# EAGLE design SSRPGenericTelemetryModule (EAGLE 6.3)
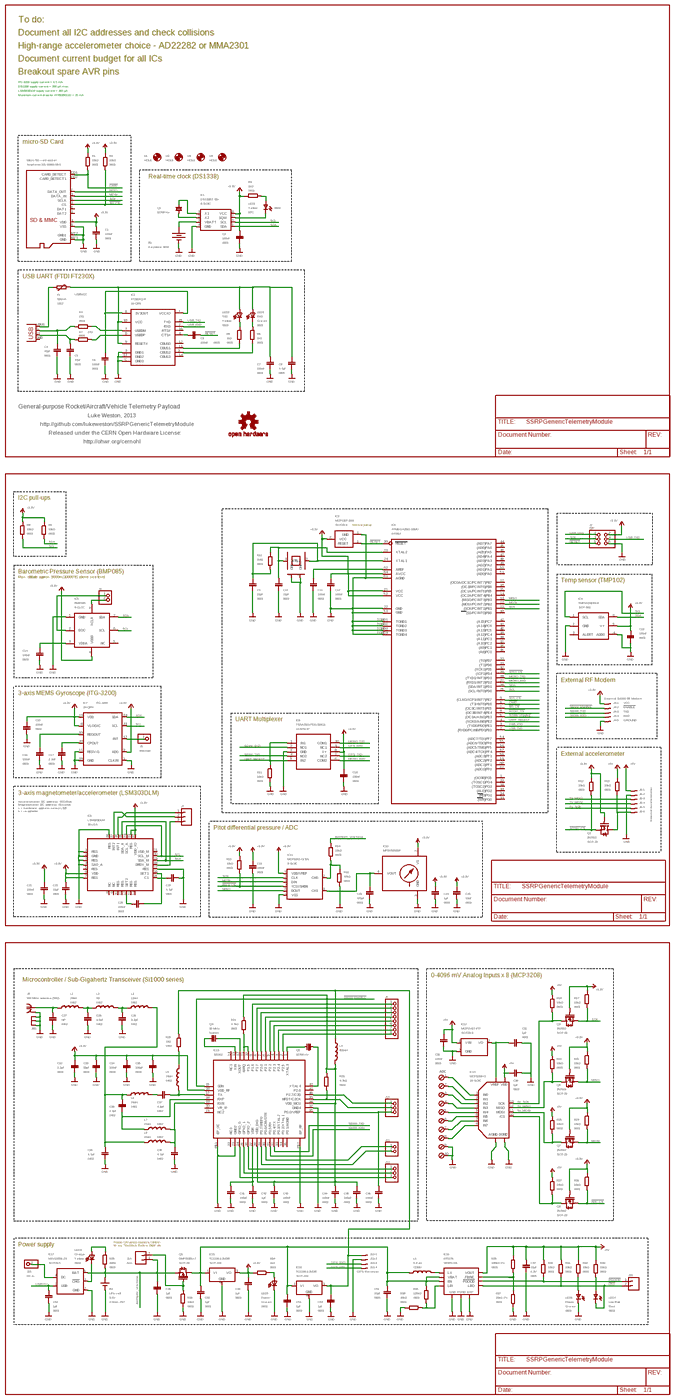
[diagram p0: schematic, sheet 1, overview]
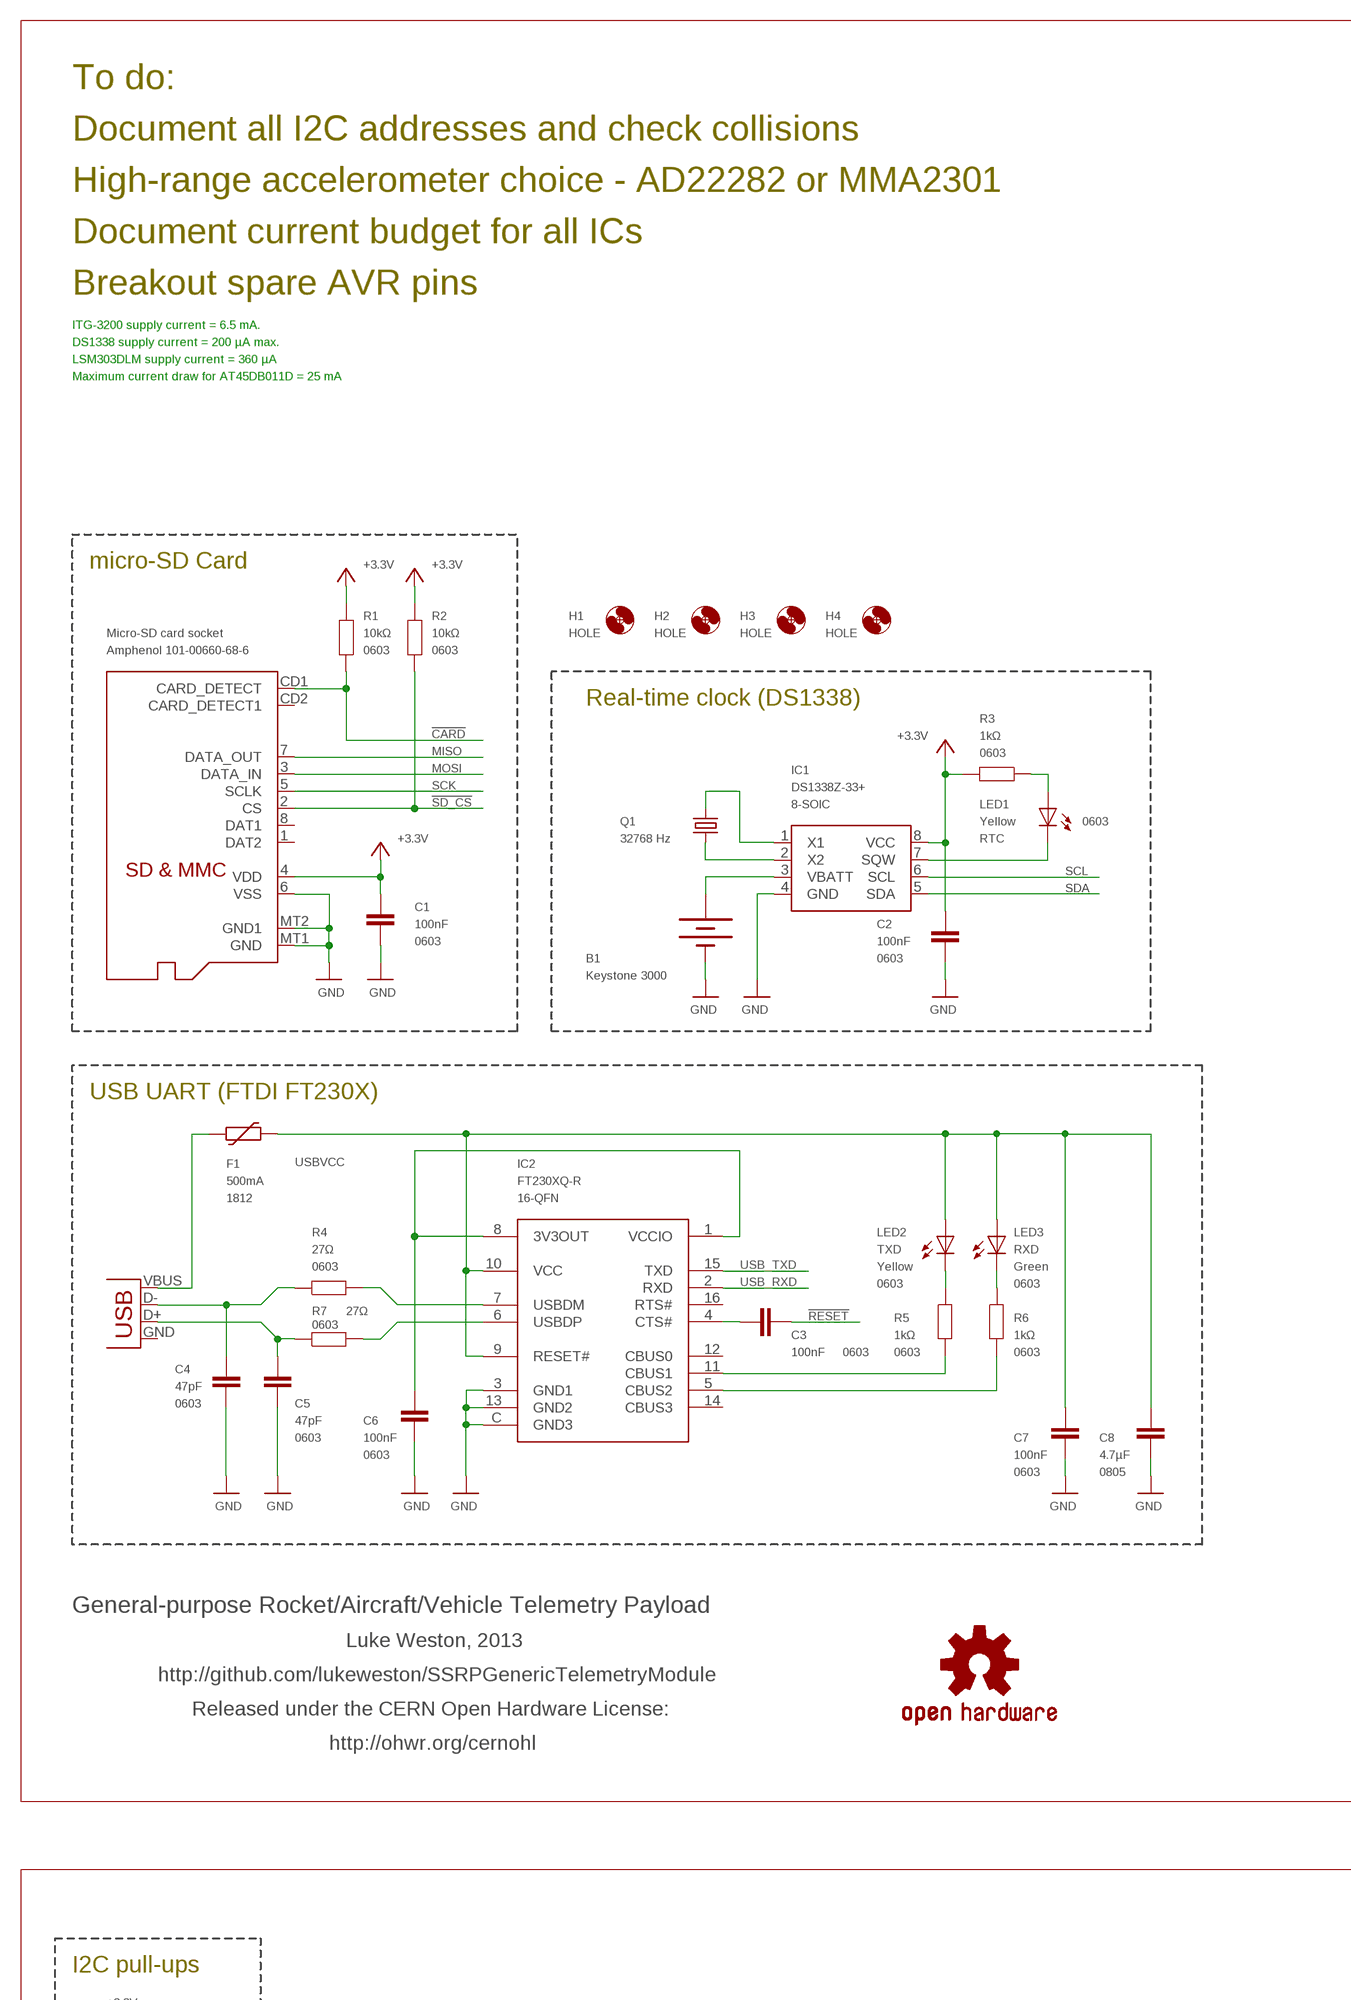
[diagram p1: schematic, sheet 1, part 1 of 6]
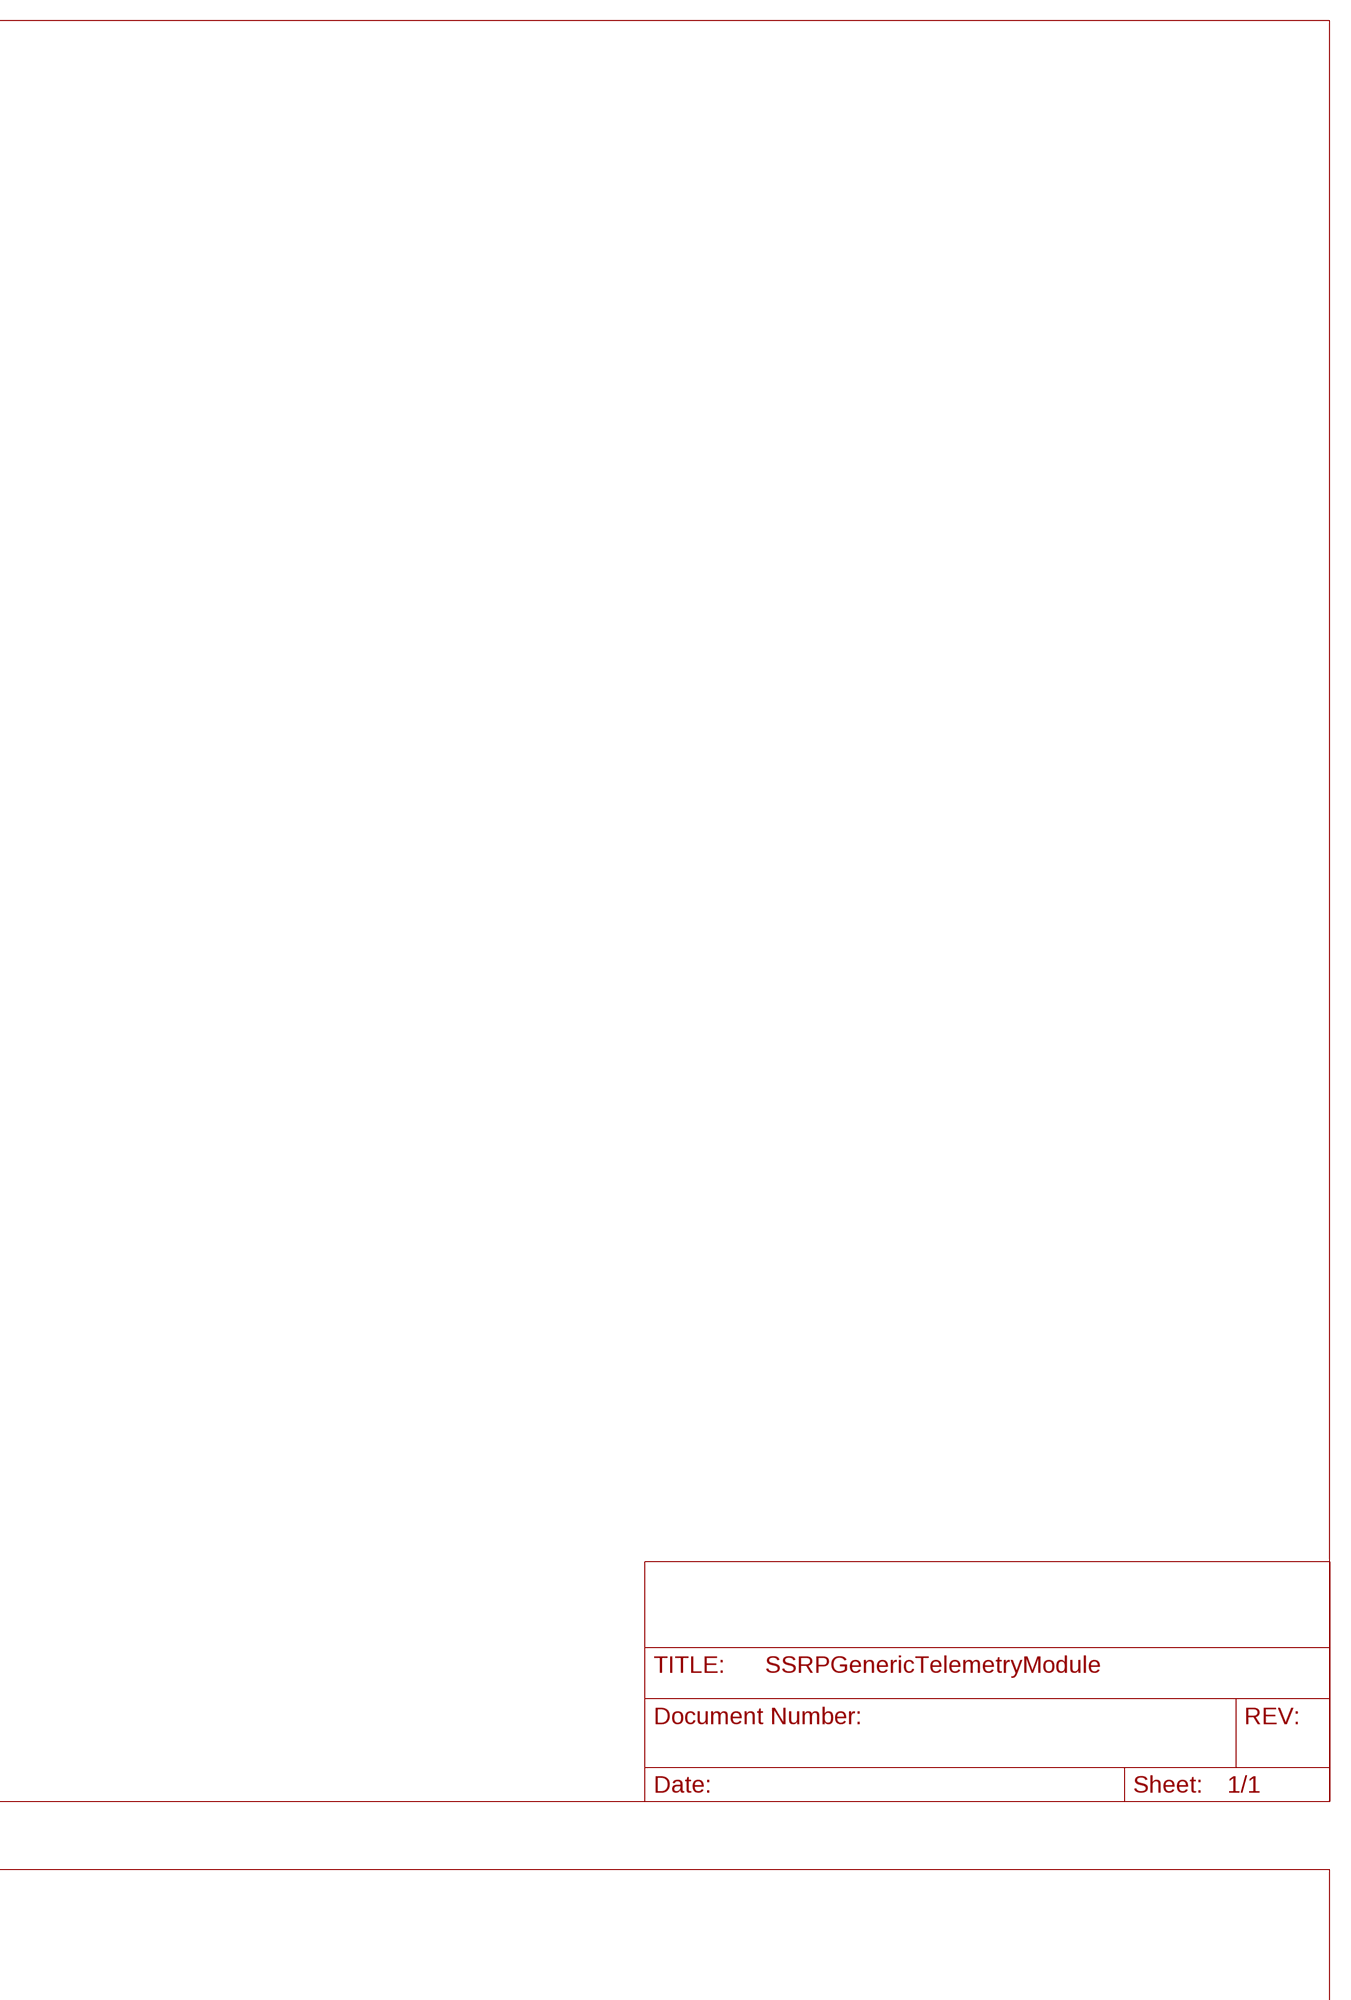
[diagram p2: schematic, sheet 1, part 2 of 6]
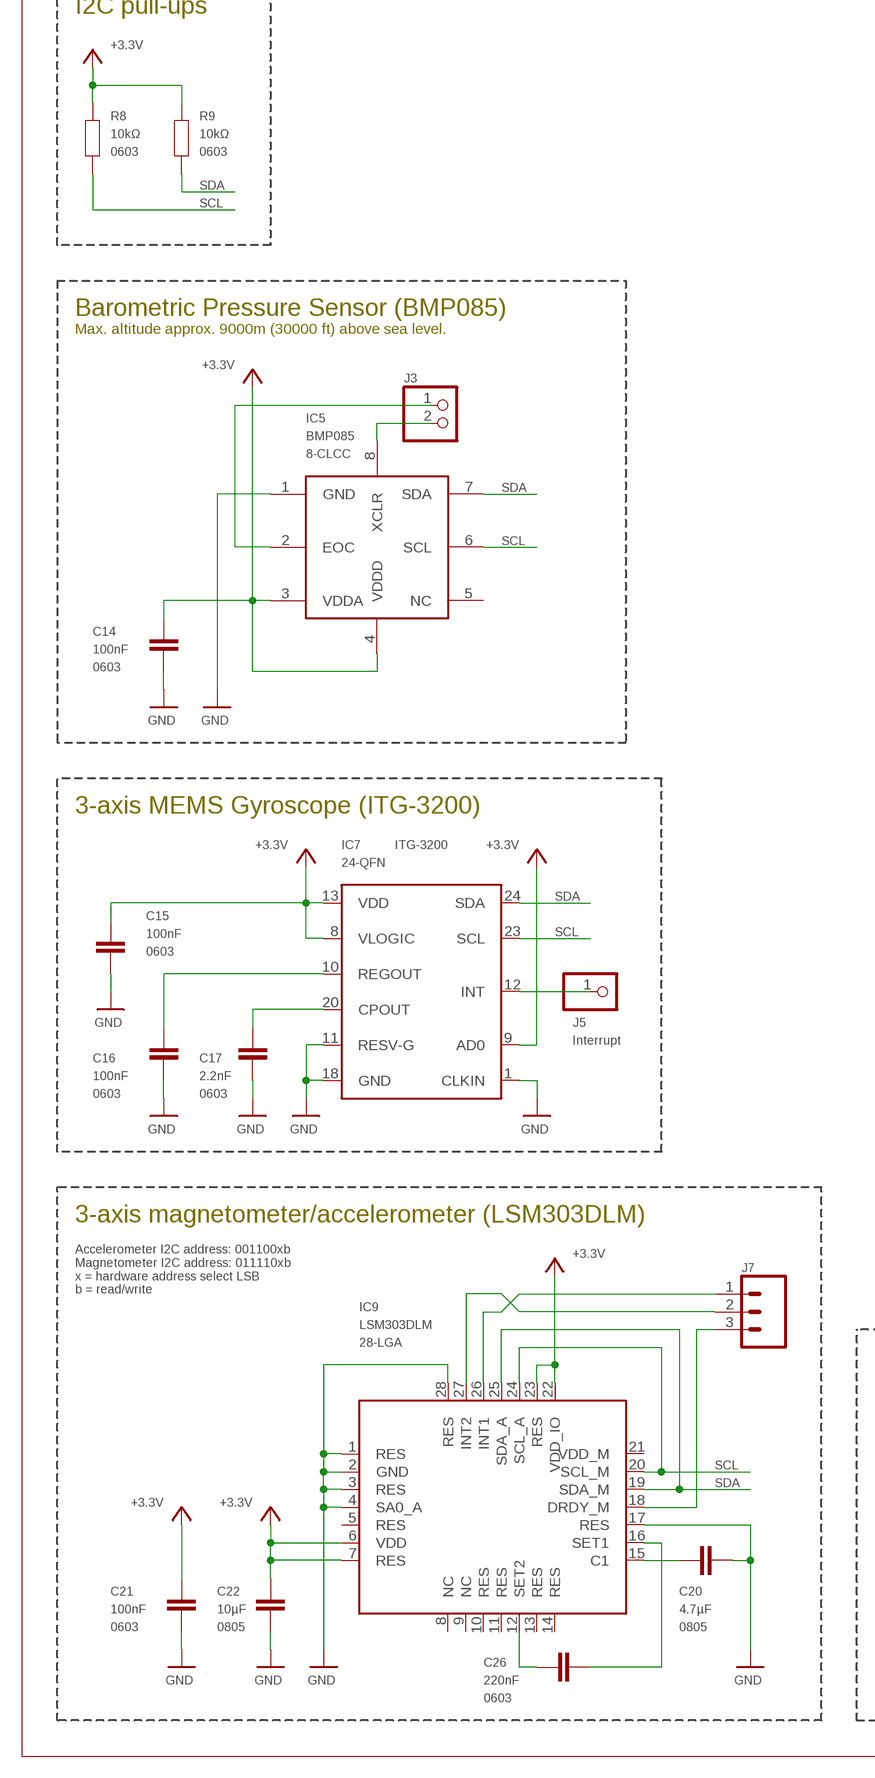
[diagram p3: schematic, sheet 1, part 3 of 6]
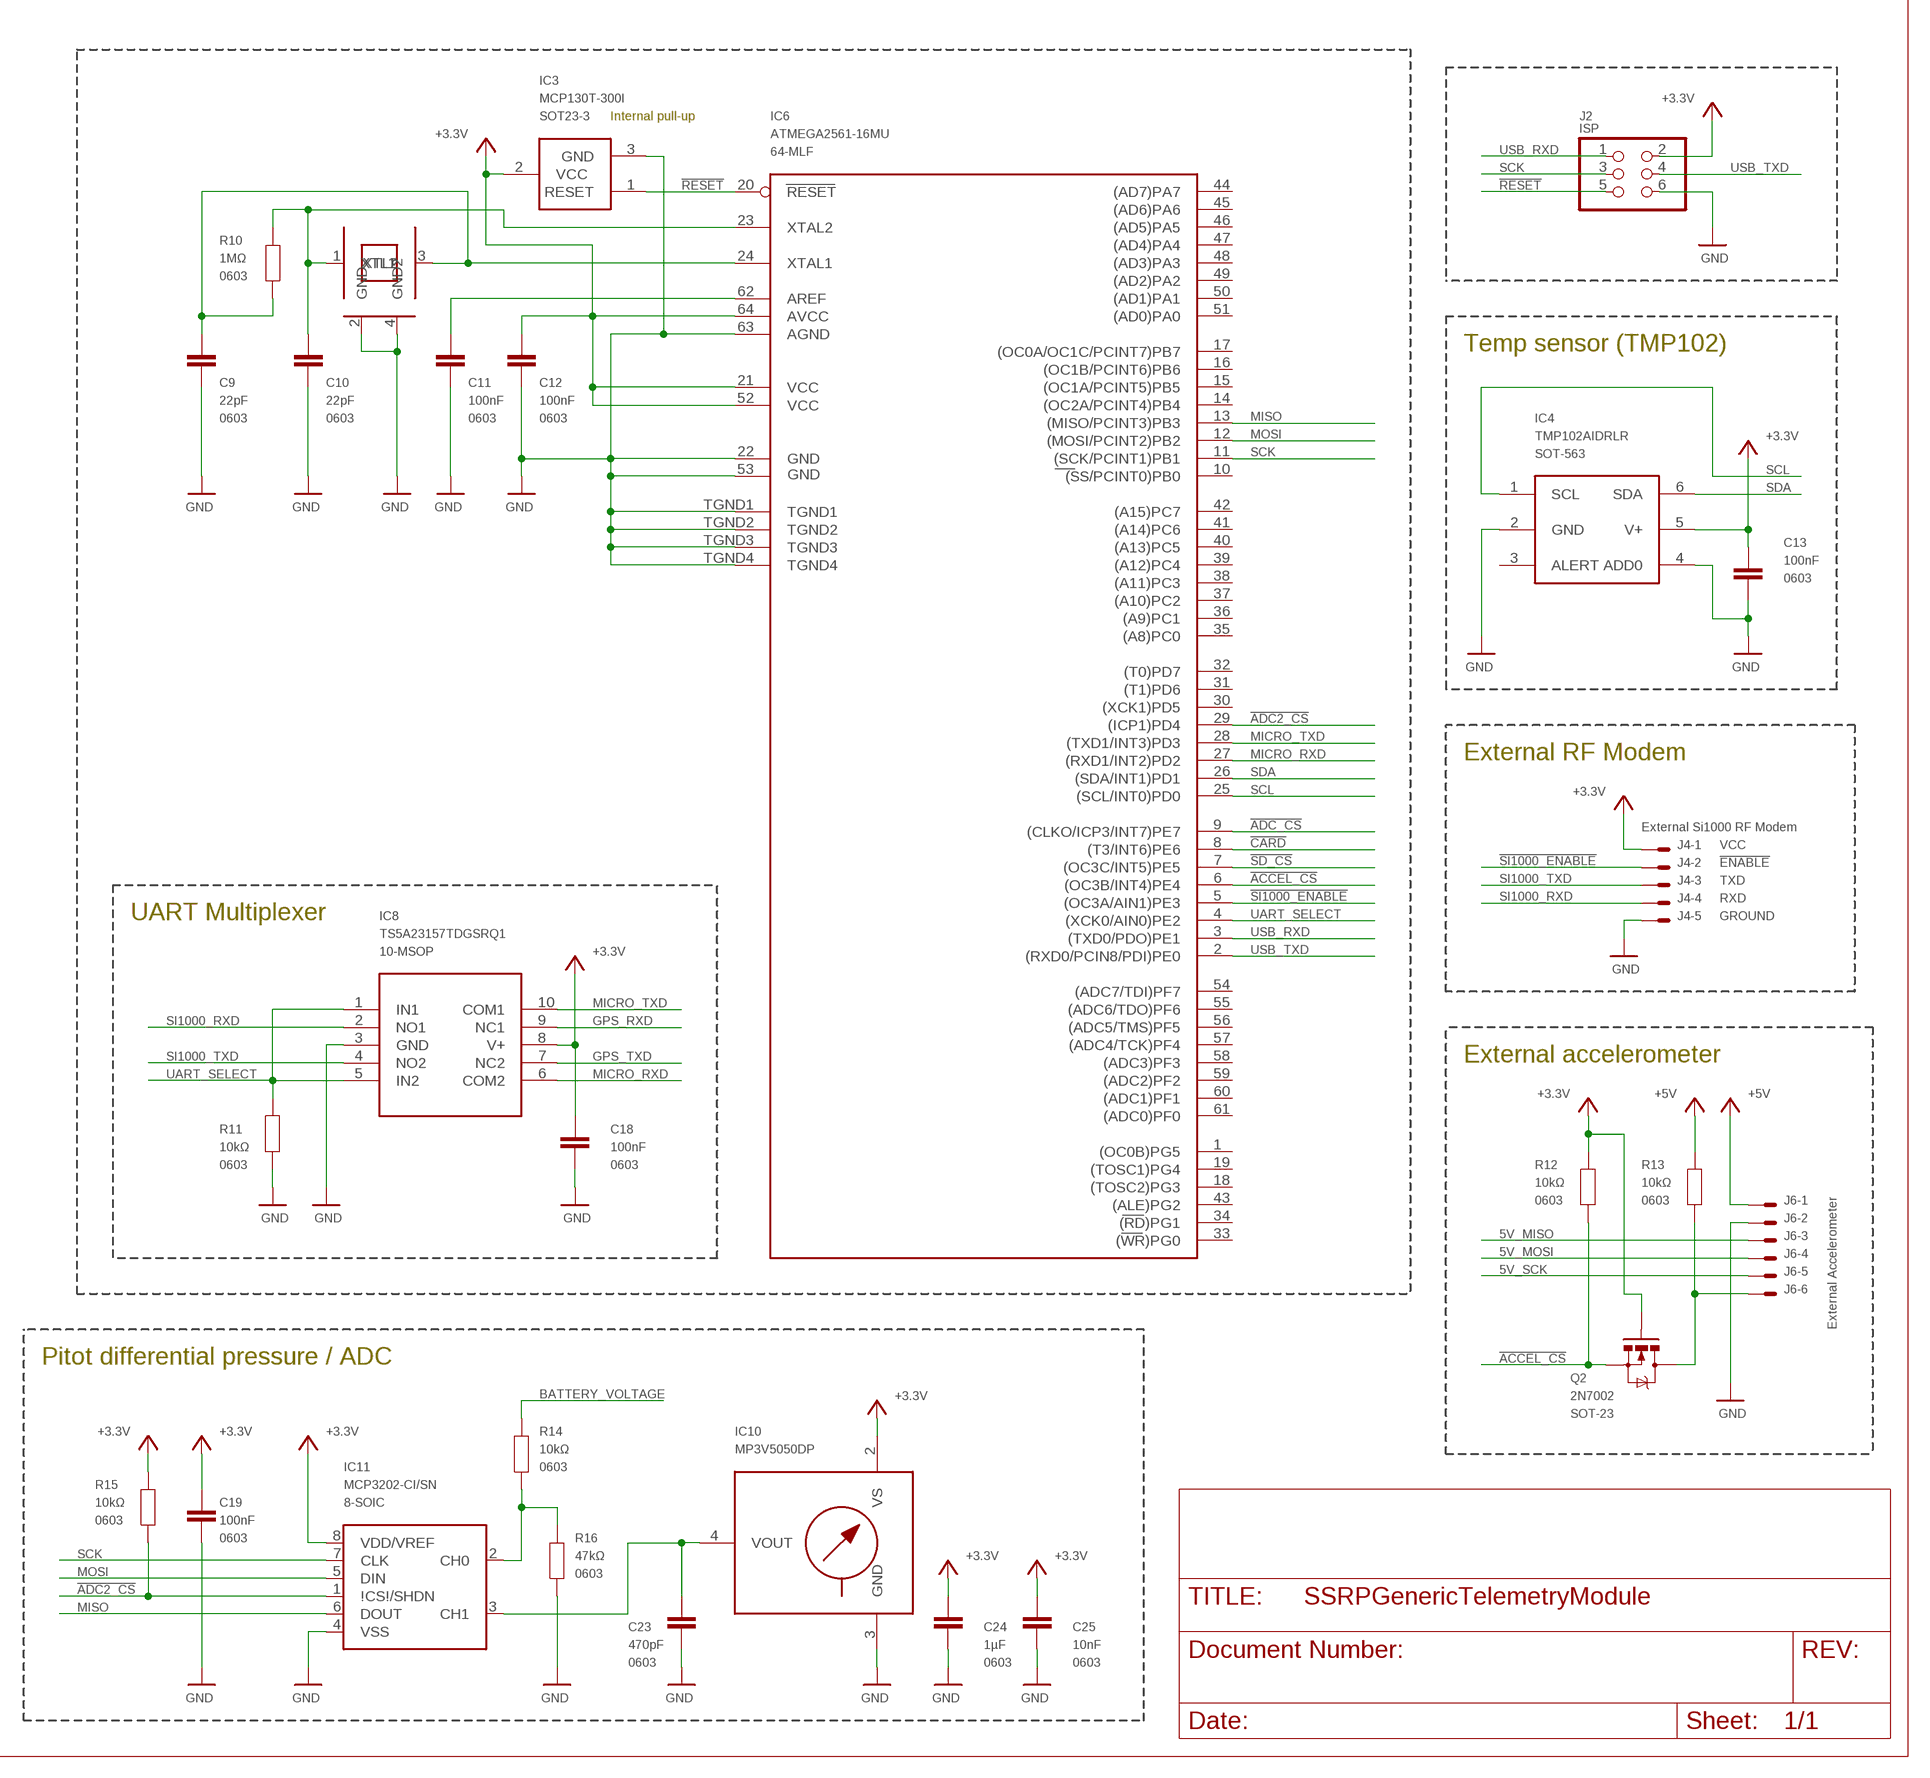
[diagram p4: schematic, sheet 1, part 4 of 6]
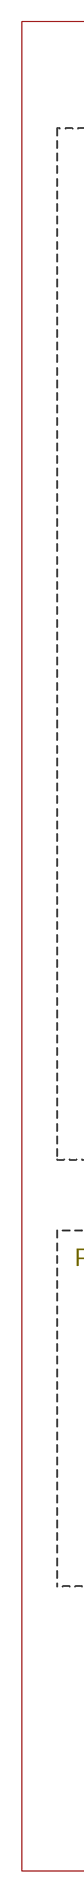
[diagram p5: schematic, sheet 1, part 5 of 6]
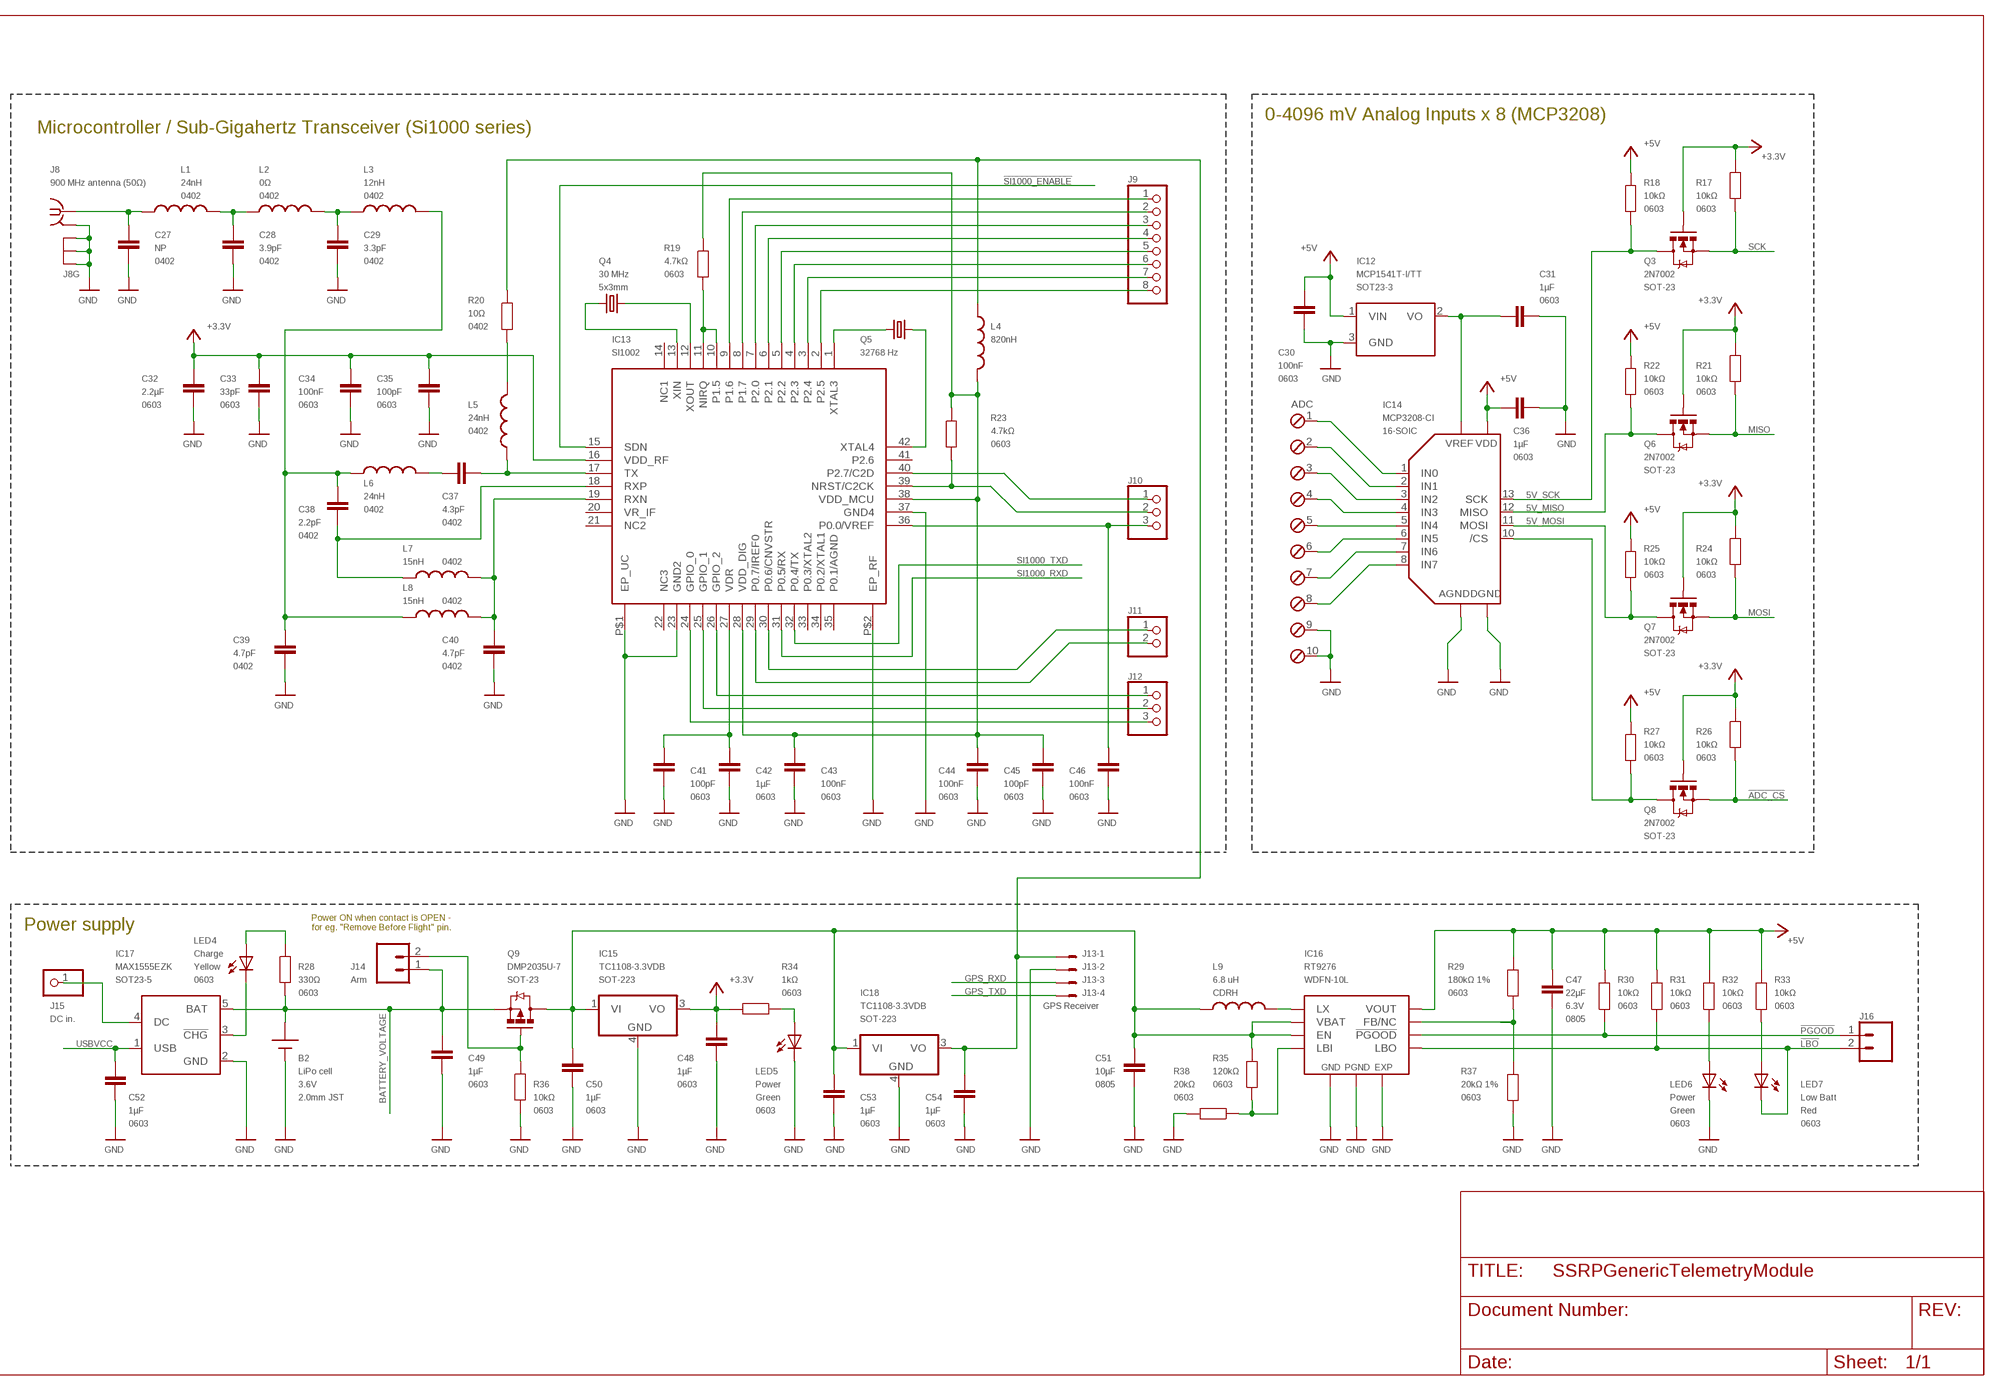
[diagram p6: schematic, sheet 1, part 6 of 6]

## Parts
B1  Keystone 3000  BATTERY12MM  [BATTCON_12MM]
B2  LiPo cell  2P-JST-TH-RA  [JST-2MM-TH-RA]
C1  100nF  CAP0603  [0603]
C2  100nF  CAP0603  [0603]
C3  100nF  CAP0603  [0603]
C4  47pF  CAP0603  [0603]
C5  47pF  CAP0603  [0603]
C6  100nF  CAP0603  [0603]
C7  100nF  CAP0603  [0603]
C8  4.7µF  CAP0805  [0805]
C9  22pF  CAP0603  [0603]
C10  22pF  CAP0603  [0603]
C11  100nF  CAP0603  [0603]
C12  100nF  CAP0603  [0603]
C13  100nF  CAP0603  [0603]
C14  100nF  CAP0603  [0603]
C15  100nF  CAP0603  [0603]
C16  100nF  CAP0603  [0603]
C17  2.2nF  CAP0603  [0603]
C18  100nF  CAP0603  [0603]
C19  100nF  CAP0603  [0603]
C20  4.7µF  CAP0805  [0805]
C21  100nF  CAP0603  [0603]
C22  10µF  CAP0805  [0805]
C23  470pF  CAP0603  [0603]
C24  1µF  CAP0603  [0603]
C25  10nF  CAP0603  [0603]
C26  220nF  CAP0603  [0603]
C27  NP  CAP0402  [C0402]
C28  3.9pF  CAP0402  [C0402]
C29  3.3pF  CAP0402  [C0402]
C30  100nF  CAP0603  [0603]
C31  1µF  CAP0603  [0603]
C32  2.2µF  CAP0603  [0603]
C33  33pF  CAP0603  [0603]
C34  100nF  CAP0603  [0603]
C35  100pF  CAP0603  [0603]
C36  1µF  CAP0603  [0603]
C37  4.3pF  CAP0402  [C0402]
C38  2.2pF  CAP0402  [C0402]
C39  4.7pF  CAP0402  [C0402]
C40  4.7pF  CAP0402  [C0402]
C41  100pF  CAP0603  [0603]
C42  1µF  CAP0603  [0603]
C43  100nF  CAP0603  [0603]
C44  100nF  CAP0603  [0603]
C45  100pF  CAP0603  [0603]
C46  100nF  CAP0603  [0603]
C47  22µF  CAP0805  [0805]
C48  1µF  CAP0603  [0603]
C49  1µF  CAP0603  [0603]
C50  1µF  CAP0603  [0603]
C51  10µF  CAP0805  [0805]
C52  1µF  CAP0603  [0603]
C53  1µF  CAP0603  [0603]
C54  1µF  CAP0603  [0603]
F1  500mA  PTC  [1812]
H1  HOLE  MOUNT-HOLE3.2  [3,2]
H2  HOLE  MOUNT-HOLE3.2  [3,2]
H3  HOLE  MOUNT-HOLE3.2  [3,2]
H4  HOLE  MOUNT-HOLE3.2  [3,2]
IC1  DS1338Z-33+  DS1307SO8  [SO08@1]
IC2  FT230XQ-R  FT230XQ  [QFN4X4-16]
IC3  MCP130T-300I  MCP130SOT  [SOT23-3]
IC4  TMP102AIDRLR  TMP102  [SOT563]
IC5  BMP085  [BMP085]
IC6  ATMEGA2561-16MU  [MLF64]
IC7  ITG-3200  [QFN-24]
IC8  TS5A23157TDGSRQ1  TS5A23157  [MSOP10]
IC9  LSM303DLM  LSM303DLHSMD  [LGA28-5X5]
IC10  MP3V5050DP  MPXV5004GDP  [1351]
IC11  MCP3202-CI/SN  MCP3202SN  [SO-08]
IC12  MCP1541T-I/TT  MC1541TT  [SOT23]
IC13  SI1002  SI1001NORMAL  [QFN42_MCM]
IC14  MCP3208-CI  MCP3208MCP3208-SOIC  [SOIC16]
IC15  TC1108-3.3VDB  LM340MP-05  [SOT223]
IC16  RT9276  [WDFN-10L-3X3]
IC17  MAX1555EZK  MAX1555  [SOT23-5L]
IC18  TC1108-3.3VDB  LM340MP-05  [SOT223]
J1  MicroSD Card  ADAFRUIT_MICROSD  [ADAFRUIT_MICROSD]
J2  ISP  ICSPPTH  [2X03PTH]
J3  PINHD-1X2  [1X02]
J4  External Si1000 RF Modem  22-23-2051  [22-23-2051]
J5  Interrupt  PINHD-1X1  [1X01]
J6  External Accelerometer  22-05-7068-06  [7395-06]
J7  M03PTH  [1X03]
J8  900 MHz antenna (50Ω)  SMA-142-0701-801/806  [J502-ND-142-0701-801/806]
J9  PINHD-1X8  [1X08]
J10  PINHD-1X3  [1X03]
J11  PINHD-1X2  [1X02]
J12  PINHD-1X3  [1X03]
J13  GPS Receiver  22-05-7048-04  [7395-04]
J14  Arm  M02PTH  [1X02]
J15  DC in.  PINHD-1X1  [1X01]
J16  Status  M02PTH  [1X02]
L1  24nH  INDUCTOR0402  [C0402]
L2  0Ω  INDUCTOR0402  [C0402]
L3  12nH  INDUCTOR0402  [C0402]
L4  820nH  INDUCTOR0402  [C0402]
L5  24nH  INDUCTOR0402  [C0402]
L6  24nH  INDUCTOR0402  [C0402]
L7  15nH  INDUCTOR0402  [C0402]
L8  15nH  INDUCTOR0402  [C0402]
L9  6.8 uH  INDUCTOR  [CDRH]
LED1  RTC  LED0603  [LED-0603]
LED2  TXD  LED0603  [LED-0603]
LED3  RXD  LED0603  [LED-0603]
LED4  Charge  LED0603  [LED-0603]
LED5  Power  LED0603  [LED-0603]
LED6  Power  LED0603  [LED-0603]
LED7  Low Batt  LED0603  [LED-0603]
Q1  32768 Hz  CRYSTAL-SMD3215_TST  [SMD3215_XTAL]
Q2  2N7002  MOSFET-NCHANNELSMD  [SOT23-3]
Q3  2N7002  MOSFET-NCHANNELSMD  [SOT23-3]
Q4  30 MHz  CRYSTAL5X3  [CRYSTAL-SMD-5X3]
Q5  32768 Hz  CRYSTAL-SMD3215_TST  [SMD3215_XTAL]
Q6  2N7002  MOSFET-NCHANNELSMD  [SOT23-3]
Q7  2N7002  MOSFET-NCHANNELSMD  [SOT23-3]
Q8  2N7002  MOSFET-NCHANNELSMD  [SOT23-3]
Q9  DMP2035U-7  [SOT23-3]
R1  10kΩ  RESISTOR0603  [0603]
R2  10kΩ  RESISTOR0603  [0603]
R3  1kΩ  RESISTOR0603  [0603]
R4  27Ω  RESISTOR0603  [0603]
R5  1kΩ  RESISTOR0603  [0603]
R6  1kΩ  RESISTOR0603  [0603]
R7  27Ω  RESISTOR0603  [0603]
R8  10kΩ  RESISTOR0603  [0603]
R9  10kΩ  RESISTOR0603  [0603]
R10  1MΩ  RESISTOR0603  [0603]
R11  10kΩ  RESISTOR0603  [0603]
R12  10kΩ  RESISTOR0603  [0603]
R13  10kΩ  RESISTOR0603  [0603]
R14  10kΩ  RESISTOR0603  [0603]
R15  10kΩ  RESISTOR0603  [0603]
R16  47kΩ  RESISTOR0603  [0603]
R17  10kΩ  RESISTOR0603  [0603]
R18  10kΩ  RESISTOR0603  [0603]
R19  4.7kΩ  RESISTOR0603  [0603]
R20  10Ω  RESISTOR0402  [C0402]
R21  10kΩ  RESISTOR0603  [0603]
R22  10kΩ  RESISTOR0603  [0603]
R23  4.7kΩ  RESISTOR0603  [0603]
R24  10kΩ  RESISTOR0603  [0603]
R25  10kΩ  RESISTOR0603  [0603]
R26  10kΩ  RESISTOR0603  [0603]
R27  10kΩ  RESISTOR0603  [0603]
R28  330Ω  RESISTOR0603  [0603]
R29  180kΩ 1%  RESISTOR0603  [0603]
R30  10kΩ  RESISTOR0603  [0603]
R31  10kΩ  RESISTOR0603  [0603]
R32  10kΩ  RESISTOR0603  [0603]
R33  10kΩ  RESISTOR0603  [0603]
R34  1kΩ  RESISTOR0603  [0603]
R35  120kΩ  RESISTOR0603  [0603]
R36  10kΩ  RESISTOR0603  [0603]
R37  20kΩ 1%  RESISTOR0603  [0603]
R38  20kΩ  RESISTOR0603  [0603]
SY  OSHW-LOGOS  [OSHW-LOGO-S]
X1  USB-MICROB  [USB-MICROB]
X2  ADC  MPT10  [10POL254]
XTL1  SMD3225-16MHZ 3.2 x 2.5mm crystal  CRYSTAL-GND3X2  [CRYSTAL-SMD-3X2]

## Nets
5V_MISO: IC14.12(MISO) J6.3 Q6.3(D) R22.1
5V_MOSI: IC14.11(MOSI) J6.4 Q7.3(D) R25.1
5V_SCK: IC14.13(SCK) J6.5 Q3.3(D) R18.1
!ACCEL_CS: IC6.6((OC3B/INT4)PE4) Q2.2(S) R12.1
!ADC2_CS: IC6.29((ICP1)PD4) IC11.1(\!CS\!/SHDN) R15.1
!ADC_CS: IC6.9((CLKO/ICP3/INT7)PE7) Q8.2(S) R26.1
!ADC_CS_5V: IC14.10(/CS) Q8.3(D) R27.1
!CARD: IC6.8((T3/INT6)PE6) J1.CD1(CARD_DETECT) R1.2
!LBO: IC16.4(LBO) J16.2 LED7.C R31.1
!PGOOD: IC16.8(!PGOOD) J16.1 R30.1
!RESET: C3.2 IC3.1(RESET) IC6.20(RESET) J2.5
!SD_CS: IC6.7((OC3C/INT5)PE5) J1.2(CS) R2.2
!SI1000_ENABLE: IC6.5((OC3A/AIN1)PE3) IC13.15(SDN) J4.2
+3V3: C1.1 C2.1 C12.1 C13.1 C14.1 C15.1 C18.2 C19.1 C21.2 C22.2 C24.1 C25.1 C32.2 C33.2 C34.2 C35.2 C48.1 IC1.8(VCC) IC3.2(VCC) IC4.5(V+) IC5.3(VDDA) IC5.4(VDDD) IC6.21(VCC) IC6.52(VCC1) IC6.64(AVCC) IC7.8(VLOGIC) IC7.9(AD0) IC7.13(VDD) IC8.8(V+) IC9.6(VDD) IC9.7(RES) IC9.22(VDD_IO) IC9.23(RES) IC10.2(VS) IC11.8(VDD/VREF) IC13.16(VDD_RF) IC15.3(VO) J1.4(VDD) J2.2 J4.1 Q2.1(G) Q3.1(G) Q6.1(G) Q7.1(G) Q8.1(G) R1.1 R2.1 R3.2 R8.2 R9.2 R12.2 R15.2 R17.2 R21.2 R24.2 R26.2 R34.2 ; supply symbol labelled +3.3V
+5V: C30.2 C36.1 C47.1 IC12.1(VIN) IC14.16(VDD) IC16.2(VOUT) J6.1 R13.2 R18.2 R22.2 R25.2 R27.2 R29.2 R30.2 R31.2 R32.2 R33.2
ANALOG_BAROMETER: C23.1 IC10.4(VOUT) IC11.3(CH1)
BATTERY_VOLTAGE: B2.+ C49.1 IC17.5(BAT) J14.1 Q9.2(S) R14.2 R28.1
FB1: IC16.3(FB/NC) R29.1 R37.2
GND: B1.GND(-) B2.- C1.2 C2.2 C4.2 C5.2 C6.2 C7.2 C8.2 C9.2 C10.2 C11.2 C12.2 C13.2 C14.2 C15.2 C16.2 C17.2 C18.1 C19.2 C20.2 C21.1 C22.1 C23.2 C24.2 C25.2 C27.2 C28.2 C29.2 C30.1 C31.2 C32.1 C33.1 C34.1 C35.1 C36.2 C39.2 C40.2 C41.1 C42.1 C43.1 C44.1 C45.1 C46.1 C47.2 C48.2 C49.2 C50.2 C51.2 C52.2 C53.2 C54.2 IC1.4(GND) IC2.3(GND1) IC2.13(GND2) IC2.C(GND3) IC3.3(GND) IC4.2(GND) IC4.4(ADD0) IC5.1(GND) IC6.22(GND) IC6.53(GND1) IC6.63(AGND) IC6.TGND1 IC6.TGND2 IC6.TGND3 IC6.TGND4 IC7.1(CLKIN) IC7.11(RESV-G) IC7.18(GND) IC8.3(GND) IC9.1(RES) IC9.2(GND) IC9.3(RES) IC9.4(SA0_A) IC9.17(RES) IC9.28(RES) IC10.3(GND) IC11.4(VSS) IC12.3(GND) IC13.23(GND2) IC13.37(GND4) IC13.EP1(GND5) IC13.EP2(GND6) IC13.EP3(GND7) IC13.EP4(GND8) IC13.EP5(GND9) IC13.EP6(GND10) IC13.EP7(GND11) IC13.EP8(GND12) IC13.P$1(EP_UC) IC13.P$2(EP_RF) IC14.9(DGND) IC14.14(AGND) IC15.4(GND) IC16.5(GND) IC16.10(PGND) IC16.EXP IC17.2(GND) IC18.4(GND) J1.6(VSS) J1.MT1(GND) J1.MT2(GND1) J2.6 J4.5 J6.2 J8.G@1(GND) J8.G@2(GND) J8.G@3(GND) J8.G@4(GND) J13.2 LED5.C LED6.C R11.1 R16.1 R36.1 R37.1 R38.1 X2.9 X2.10 XTL1.2(GND) XTL1.4(GND2)
GPS_RXD: IC8.9(NC1) J13.3
GPS_TXD: IC8.7(NC2) J13.4
LBI1: IC16.7(LBI) R35.1 R38.2
LX1: IC16.9(LX) L9.2
MICRO_RXD: IC6.27((RXD1/INT2)PD2) IC8.6(COM2)
MICRO_TXD: IC6.28((TXD1/INT3)PD3) IC8.10(COM1)
MISO: IC6.13((MISO/PCINT3)PB3) IC11.6(DOUT) J1.7(DATA_OUT) Q6.2(S) R21.1
MOSI: IC6.12((MOSI/PCINT2)PB2) IC11.5(DIN) J1.3(DATA_IN) Q7.2(S) R24.1
N$1: J6.6 Q2.3(D) R13.1
N$2: C43.2 C44.2 C45.2 IC13.28(VDD_DIG) IC13.38(VDD_MCU) L4.1 R19.2 R23.2
N$3: C38.2 IC13.18(RXP) L7.2
N$4: IC13.40(P2.7/C2D) J10.1
N$5: IC9.18(DRDY_M) J7.3
N$6: C27.1 J8.1 L1.1
N$7: IC13.1(XTAL3) Q5.X2
N$8: IC13.42(XTAL4) Q5.X1
N$9: IC13.30(P0.6/CNVSTR) J11.1
N$10: IC9.27(INT2) J7.2
N$11: C11.1 IC6.62(AREF)
N$12: IC1.2(X2) Q1.X2
N$13: B1.PWR@1(+) IC1.3(VBATT)
N$14: IC1.1(X1) Q1.X1
N$15: IC1.7(SQW) LED1.C
N$16: IC9.26(INT1) J7.1
N$17: C26.1 IC9.12(SET2)
N$18: C26.2 IC9.16(SET1)
N$19: C10.1 IC6.23(XTAL2) R10.1 XTL1.1(XTL1)
N$20: C20.1 IC9.15(C1)
N$21: IC13.29(P0.7/IREF0) J11.2
N$22: IC7.12(INT) J5.1
N$23: C9.1 IC6.24(XTAL1) R10.2 XTL1.3(XTL2)
N$24: LED1.A R3.1
N$25: C16.1 IC7.10(REGOUT)
N$26: LED2.C R5.2
N$27: C17.1 IC7.20(CPOUT)
N$28: C54.1 IC18.3(VO) J13.1 L4.2 R20.2
N$29: IC14.8(IN7) X2.8
N$30: IC14.7(IN6) X2.7
N$31: LED3.C R6.2
N$32: C6.1 IC2.1(VCCIO) IC2.8(3V3OUT)
N$33: IC5.8(XCLR) J3.2
N$34: IC5.2(EOC) J3.1
N$35: IC11.2(CH0) R14.1 R16.2
N$36: IC14.6(IN5) X2.6
N$37: IC14.5(IN4) X2.5
N$38: IC14.4(IN3) X2.4
N$39: IC14.3(IN2) X2.3
N$40: IC14.2(IN1) X2.2
N$41: IC14.1(IN0) X2.1
N$42: IC2.7(USBDM) R4.2
N$43: C31.1 IC12.2(VO) IC14.15(VREF)
N$44: LED6.A R32.1
N$45: IC2.6(USBDP) R7.2
N$46: C5.1 R7.1 X1.D+
N$47: C4.1 R4.1 X1.D-
N$48: F1.1 X1.VBUS
N$49: IC2.11(CBUS1) R5.1
N$50: IC2.5(CBUS2) R6.1
N$51: C3.1 IC2.4(CTS#)
N$52: LED7.A R33.1
N$54: IC13.24(GPIO_0) J12.3
N$55: IC13.25(GPIO_1) J12.2
N$56: IC13.26(GPIO_2) J12.1
N$58: C41.2 C42.2 IC13.27(VDR)
N$59: C46.2 IC13.36(P0.0/VREF) J10.3
N$60: J14.2 Q9.1(G) R36.2
N$61: IC17.3(!CHG) LED4.C
N$64: LED4.A R28.2
N$65: IC17.4(DC) J15.1
N$68: LED5.A R34.1
N$69: IC13.39(NRST/C2CK) J10.2 R23.1
N$74: IC13.2(P2.5) J9.8
N$75: IC13.3(P2.4) J9.7
N$76: IC13.4(P2.3) J9.6
N$77: IC13.5(P2.2) J9.5
N$78: IC13.6(P2.1) J9.4
N$79: IC13.7(P2.0) J9.3
N$80: IC13.8(P1.7) J9.2
N$81: IC13.9(P1.6) J9.1
N$82: IC13.10(P1.5) IC13.11(NIRQ) R19.1
N$83: IC13.12(XOUT) Q4.3
N$84: IC13.13(XIN) Q4.1
N$86: C37.1 IC13.17(TX) L5.1
N$87: C37.2 L6.2
N$89: C40.1 IC13.19(RXN) L7.1 L8.1
N$90: L5.2 R20.1
N$92: C28.1 L1.2 L2.1
N$93: C29.1 L2.2 L3.1
N$96: C38.1 C39.1 L3.2 L6.1 L8.2
SCK: IC6.11((SCK/PCINT1)PB1) IC11.7(CLK) J1.5(SCLK) J2.3 Q3.2(S) R17.1
SCL: IC1.6(SCL) IC4.1(SCL) IC5.6(SCL) IC6.25((SCL/INT0)PD0) IC7.23(SCL) IC9.20(SCL_M) IC9.24(SCL_A) R8.1
SDA: IC1.5(SDA) IC4.6(SDA) IC5.7(SDA) IC6.26((SDA/INT1)PD1) IC7.24(SDA) IC9.19(SDA_M) IC9.25(SDA_A) R9.1
SI1000_RXD: IC8.2(NO1) IC13.31(P0.5/RX) J4.4
SI1000_TXD: IC8.4(NO2) IC13.32(P0.4/TX) J4.3
UART_SELECT: IC6.4((XCK0/AIN0)PE2) IC8.1(IN1) IC8.5(IN2) R11.2
USB_RXD: IC2.2(RXD) IC6.3((TXD0/PDO)PE1) J2.1
USB_TXD: IC2.15(TXD) IC6.2((RXD0/PCIN8/PDI)PE0) J2.4
USBVCC: C7.1 C8.1 C52.1 F1.2 IC2.9(RESET#) IC2.10(VCC) IC17.1(USB) LED2.A LED3.A
V_BATT: C50.1 C51.1 C53.1 IC15.1(VI) IC16.1(EN) IC16.6(VBAT) IC18.1(VI) L9.1 Q9.3(D) R35.2
Unconnected: IC2.12(CBUS0) IC2.14(CBUS3) IC2.16(RTS#) IC4.3(ALERT) IC5.5(NC) IC6.1((OC0B)PG5) IC6.10((SS/PCINT0)PB0) IC6.14((OC2A/PCINT4)PB4) IC6.15((OC1A/PCINT5)PB5) IC6.16((OC1B/PCINT6)PB6) IC6.17((OC0A/OC1C/PCINT7)PB7) IC6.18((TOSC2)PG3) IC6.19((TOSC1)PG4) IC6.30((XCK1)PD5) IC6.31((T1)PD6) IC6.32((T0)PD7) IC6.33((WR)PG0) IC6.34((RD)PG1) IC6.35((A8)PC0) IC6.36((A9)PC1) IC6.37((A10)PC2) IC6.38((A11)PC3) IC6.39((A12)PC4) IC6.40((A13)PC5) IC6.41((A14)PC6) IC6.42((A15)PC7) IC6.43((ALE)PG2) IC6.44((AD7)PA7) IC6.45((AD6)PA6) IC6.46((AD5)PA5) IC6.47((AD4)PA4) IC6.48((AD3)PA3) IC6.49((AD2)PA2) IC6.50((AD1)PA1) IC6.51((AD0)PA0) IC6.54((ADC7/TDI)PF7) IC6.55((ADC6/TDO)PF6) IC6.56((ADC5/TMS)PF5) IC6.57((ADC4/TCK)PF4) IC6.58((ADC3)PF3) IC6.59((ADC2)PF2) IC6.60((ADC1)PF1) IC6.61((ADC0)PF0) IC9.5(RES) IC9.8(NC) IC9.9(NC) IC9.10(RES) IC9.11(RES) IC9.13(RES) IC9.14(RES) IC9.21(VDD_M) IC10.1(NC) IC10.5(NC) IC10.6(NC) IC13.14(NC1) IC13.21(NC2) IC13.22(NC3) IC13.33(P0.3/XTAL2) IC13.34(P0.2/XTAL1) IC13.35(P0.1/AGND) IC13.41(P2.6) J1.1(DAT2) J1.8(DAT1) J1.CD2(CARD_DETECT1) X1.GND

## Notes on the sheet
- To do:
- Document all I2C addresses and check collisions
- High-range accelerometer choice - AD22282 or MMA2301
- Document current budget for all ICs
- Breakout spare AVR pins
- ITG-3200 supply current = 6.5 mA.
- DS1338 supply current = 200 µA max.
- LSM303DLM supply current = 360 µA
- Maximum current draw for AT45DB011D = 25 mA
- micro-SD Card
- Micro-SD card socket
- Amphenol 101-00660-68-6
- Real-time clock (DS1338)
- USB UART (FTDI FT230X)
- FT230XQ-R
- General-purpose Rocket/Aircraft/Vehicle Telemetry Payload
- Luke Weston, 2013
- http://github.com/lukeweston/SSRPGenericTelemetryModule
- Released under the CERN Open Hardware License:
- http://ohwr.org/cernohl
- I2C pull-ups
- Internal pull-up
- Barometric Pressure Sensor (BMP085)
- Max. altitude approx. 9000m (30000 ft) above sea level.
- Temp sensor (TMP102)
- IC5
- BMP085
- 8-CLCC
- External RF Modem
- 3-axis MEMS Gyroscope (ITG-3200)
- VCC
- !ENABLE
- TXD
- RXD
- UART Multiplexer | GROUND
- External accelerometer
- 3-axis magnetometer/accelerometer (LSM303DLM)
- Accelerometer I2C address: 001100xb
  Magnetometer I2C address: 011110xb
  x = hardware address select LSB
  b = read/write
- Pitot differential pressure / ADC
- 0-4096 mV Analog Inputs x 8 (MCP3208)
- Microcontroller / Sub-Gigahertz Transceiver (Si1000 series)
- Power supply
- Power ON when contact is OPEN -
  for eg. "Remove Before Flight" pin.

## Power pins joined to a net without a drawn wire
VR_IF: IC13.20(VR_IF)

## Library data of the parts
B1 = SparkFun:BATTERY: Battery Holders Various common sizes : AA, AAA, 20mm coin cell and 12mm coin cell.
B2 = freetronics-luke:2P-JST-TH-RA: 2.0 mm pitch, through-hole 2-pin right-angle JST header, suitable for small Li-po batteries.; CONN: 2.0mm JST; VOLTAGE: 3.6V
C1-C7 C9-C19 C21 C23-C26 C30-C36 C41-C46 C48-C50 C52-C54 = freetronics-master-v1:CAP: Capacitor Standard 0603 ceramic capacitor, and 0.1" leaded capacitor.; PACKAGE: 0603
C8 C20 C22 C51 = freetronics-master-v1:CAP: Capacitor Standard 0603 ceramic capacitor, and 0.1" leaded capacitor.; PACKAGE: 0805
C27-C29 C37-C40 = freetronics-master-v1:CAP: Capacitor Standard 0603 ceramic capacitor, and 0.1" leaded capacitor.; PACKAGE: 0402
C47 = freetronics-master-v1:CAP: Capacitor Standard 0603 ceramic capacitor, and 0.1" leaded capacitor.; PACKAGE: 0805; VOLTAGE: 6.3V
F1 = freetronics-luke:PTC: Polymeric PTC ("Polyfuse"); PACKAGE: 1812
H1-H4 = holes:MOUNT-HOLE: MOUNTING HOLE with drill center marker
IC1 = SparkFun:DS1307; PACKAGE: 8-SOIC
IC2 = serial:FT230XQ; PACKAGE: 16-QFN
IC3 = SparkFun:MCP130; PACKAGE: SOT23-3
IC4 = SparkFun:TMP102; PACKAGE: SOT-563
IC5 = SparkFun:BMP085
IC6 = freetronics-jon:ATMEGA2561*: MICROCONTROLLER 256 Kbytes FLASH 4 Kbytes EEPROM 8 Kbytes SRAM 54 General Purpose I/O pins 6-channels 16-bit PWM 2 x Serial USARTs 8-channels 10-bit A/D; PACKAGE: 64-MLF
IC7 = SparkFun:ITG-3200: ITG-3200 3-axis gyro, digital output, qfn24 package; PACKAGE: 24-QFN
IC8 = 3DRobotics:TS5A23157: TS5A23157 Dual 10-Ohm SPDT Analog Switch The TS5A23157 is a dual single-pole double-throw (SPDT) analog switch designed to operate from 1.65 V to 5.5 V. This device can handle both digital and analog signals. Signals up to 5.5 V (peak) can be transmitted in either direction.; DATASHEET: http://focus.ti.com/lit/ds/symlink/ts5a23157.pdf; LINK: http://focus.ti.com/docs/prod/folders/print/ts5a23157.html; MFGPN: TS5A23157DGSR; PACKAGE: 10-MSOP
IC9 = SparkFun:LSM303DLH; PACKAGE: 28-LGA
IC10 = mpx-freescale:MPXV5004G: Integrated Silicon Pressure Sensor On-Chip Signal Conditioned, Temperature Compensated and Calibrated INTEGRATED PRESSURE SENSOR 0 TO 3.92 kPA (0 TO 400 mm H2O) 1.0 TO 4.9 V OUTPUT
IC11 = microchip-update-2:MCP3202: 2.7V Dual Channel 12-Bit A/D Converter with SPI Serial Interface Source: http://ww1.microchip.com/downloads/en/DeviceDoc/21034D.pdf; PACKAGE: 8-SOIC
IC12 = microchip:MC15*: 2.5V and 4.096V Voltage References Source: http://www.microchip.com .. 21653b.pdf; OC_FARNELL: unknown; OC_NEWARK: unknown; PACKAGE: SOT23-3
IC13 = SiLabsMCU:SI1001
IC14 = Luke:MCP3208; PACKAGE: 16-SOIC
IC15 IC18 = linear:LM340?-*: Positive VOLTAGE REGULATOR Source: http://cache.national.com/ds/LM/LM340.pdf; PACKAGE: SOT-223
IC16 = freetronics-luke:RT9276: Richtek RT9276 boost converter. www.richtek.com/download_ds.jsp?s=631; PACKAGE: WDFN-10L
IC17 = maxim:MAX1555: Dual-Input USB/AC Adapter 1-Cell Li+ Battery Chargers Source: http://www.maxim-ic.com .. MAX1551-MAX1555.pdf; MF: MAXIM; MPN: MAX1555EZK+T; OC_FARNELL: 1628222; OC_NEWARK: 59J2761; PACKAGE: SOT23-5
J1 = RAMPSdisplay:ADAFRUIT_MICROSD: Micro-SD / Transflash card holder with SPI pinout For the 3M # 2908-05WB-MG and/or 4UCON #19656 push-push type
J2 = freetronics-jon:ICSP
J3 J11 = pinhead:PINHD-1X2: PIN HEADER
J4 = con-molex:22-23-2051: .100" (2.54mm) Center Header - 5 Pin; MF: MOLEX; MPN: 22-23-2051; OC_FARNELL: 1462952; OC_NEWARK: 38C9178
J5 J15 = pinhead:PINHD-1X1: PIN HEADER
J6 = con-molex:22-?-06: CONNECTOR wire to board 2.54 mm (.1 inch) pitch header; OC_FARNELL: unknown; OC_NEWARK: unknown
J7 = freetronics-master-v1:M03: Header 3 Standard 3-pin 0.1" header. Use with straight break away headers (SKU : PRT-00116), right angle break away headers (PRT-00553), swiss pins (PRT-00743), machine pins (PRT-00117), and female headers (PRT-00115). Molex polarized connector foot print use with SKU : PRT-08232 with associated crimp pins and housings.
J8 = con-coax:SMA-: SMA 50 Ohm End Launch Jack Receptacle - Round Contact Johnson Components Source: www.johnsoncomponents.com .. J502-ND.pdf; MF: JOHNSON COMPONENTS; MPN: 142-0701-801; OC_FARNELL: 1608592; OC_NEWARK: 90F2624
J9 = pinhead:PINHD-1X8: PIN HEADER
J10 J12 = pinhead:PINHD-1X3: PIN HEADER
J13 = con-molex:22-?-04: CONNECTOR wire to board 2.54 mm (.1 inch) pitch header; OC_FARNELL: unknown; OC_NEWARK: unknown
J14 J16 = freetronics-master-v1:M02: Header 2 Standard 2-pin 0.1" header. Use with straight break away headers (SKU : PRT-00116), right angle break away headers (PRT-00553), swiss pins (PRT-00743), machine pins (PRT-00117), and female headers (PRT-00115). Molex polarized connector foot print use with SKU : PRT-08233 with associated crimp pins and housings.
L1-L3 L5-L8 = freetronics-master-v1:INDUCTOR: Inductors Basic Inductor/Choke - 0603 and 1206. Footprints are not proven and vary greatly between part numbers.; PACKAGE: 0402
L4 = freetronics-master-v1:INDUCTOR: Inductors Basic Inductor/Choke - 0603 and 1206. Footprints are not proven and vary greatly between part numbers.
L9 = freetronics-luke:INDUCTOR; PACKAGE: CDRH
LED1 LED2 LED4 = freetronics-master-v1:LED: LEDs Standard schematic elements and footprints for 5mm, 3mm, 1206, and 0603 sized LEDs. 5mm - Spark Fun Electronics SKU : COM-00529 (and others); COLOUR: Yellow; PACKAGE: 0603
LED3 LED5 LED6 = freetronics-master-v1:LED: LEDs Standard schematic elements and footprints for 5mm, 3mm, 1206, and 0603 sized LEDs. 5mm - Spark Fun Electronics SKU : COM-00529 (and others); COLOUR: Green; PACKAGE: 0603
LED7 = freetronics-master-v1:LED: LEDs Standard schematic elements and footprints for 5mm, 3mm, 1206, and 0603 sized LEDs. 5mm - Spark Fun Electronics SKU : COM-00529 (and others); COLOUR: Red; PACKAGE: 0603
Q1 Q5 = dzo:CRYSTAL-SMD3215_TST
Q2 Q3 Q6-Q8 = freetronics-master-v1.1:MOSFET-NCHANNEL; PACKAGE: SOT-23
Q4 = freetronics-master-v1:CRYSTAL: Crystals Various standard crystals. Proven footprints. Spark Fun Electronics SKU : COM-00534; PACKAGE: 5x3mm
Q9 = freetronics-luke:DMP2035U-7: DMP2035U P-channel MOSFET in SOT-23.; PACKAGE: SOT-23
R1-R19 R21-R38 = freetronics-master-v1:RESISTOR: Resistor Basic schematic elements and footprints for 0603, 1206, and PTH 1/10th watt (small) resistors.; PACKAGE: 0603
R20 = freetronics-master-v1:RESISTOR: Resistor Basic schematic elements and footprints for 0603, 1206, and PTH 1/10th watt (small) resistors.; PACKAGE: 0402
SY = SparkFun:OSHW-LOGO: Open Source Hardware Logo This logo indicates the piece of hardware it is found on incorporates a OSHW license and/or adheres to the definition of open source hardware found here: http://freedomdefined.org/OSHW
X1 = freetronics-master-v1:USB: USB Connectors USB-B-PTH is fully proven SKU : PRT-00139 USB-miniB is fully proven SKU : PRT-00587 USB-A-PCB is untested. USB-A-H is throughly reviewed, but untested. Spark Fun Electronics SKU : PRT-00437 USB-B-SMT is throughly reviewed, but untested. Needs silkscreen touching up. USB-A-S has not been used/tested USB-MB-H has not been used/tested
X2 = con-phoenix-254:MPT10: PHOENIX CONNECTOR; OC_FARNELL: unknown; OC_NEWARK: unknown
XTL1 = freetronics-jon:CRYSTAL-GND

## Net classes
1 vcc: width 0.254 mm

## Board
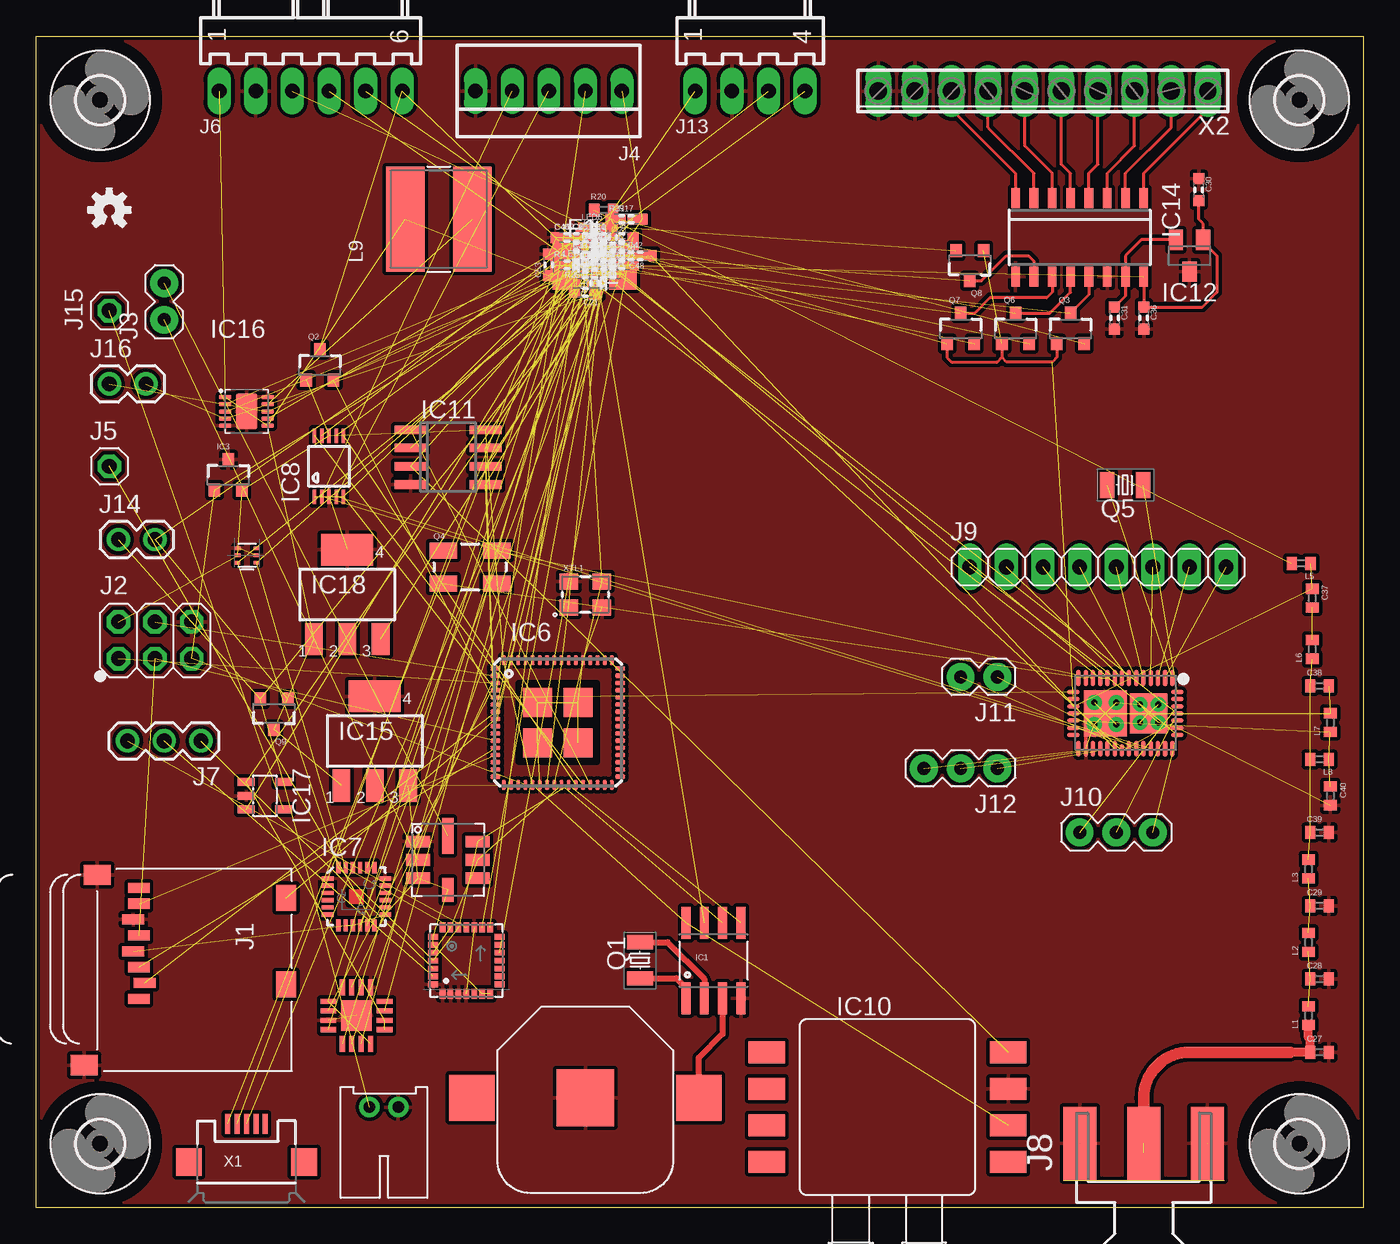
[diagram p7: board, top side]
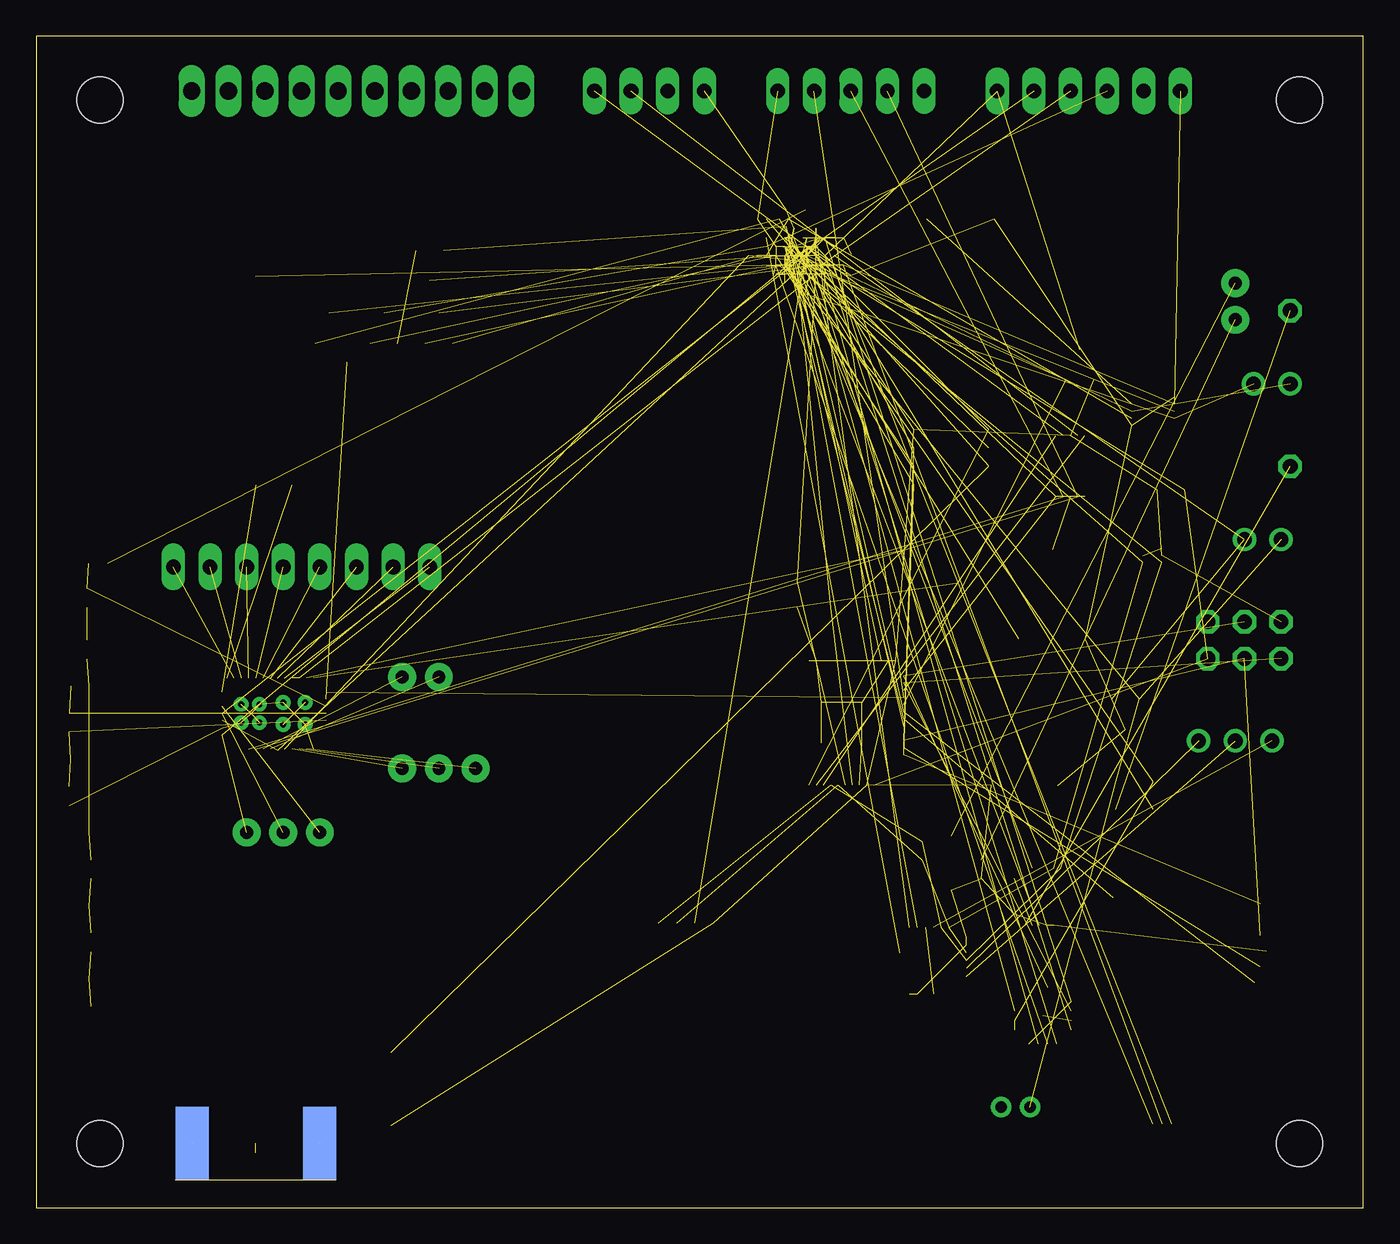
[diagram p8: board, bottom side, seen from below]

Size 92.08 x 81.28 mm. Coordinates in mm from the lower left corner, seen from the top.
Outline: 0,81.28 92.08,81.28 92.08,0 0,0 0,81.28
Copper layers (1*16): Top 0.035mm / dielectric 1.5mm / Bottom 0.035mm
Design rules "SparkFun": minimum track width 8mil, minimum drill 20mil, track to track 8mil, track to pad 8mil, pad to pad 8mil, via to via 8mil, smd to smd 8mil, copper to edge 8mil, drill to drill 8mil, minimum pad ring 12mil, minimum via ring 10mil, stop-mask expansion 4mil, vias tented up to drill 20mil, thermal gap 10mil

### Footprints (pad centres in the part's own frame; a part is rotated, then mirrored left to right if it is on the bottom)
BATTCON_12MM = smd 3.962 x 3.962: GND 0,0 | smd 3.175 x 3.175: PWR@1 -7.874,0; PWR@2 7.874,0
JST-2MM-TH-RA = drill 0.8 pad 1.422: + 1,-3.81; - -1,-3.81
0603 = smd 0.762 x 0.762: 1 -0.762,0; 2 0.762,0
0805 = smd 0.8 x 1.2: 1 -0.9,0; 2 0.9,0
C0402 = smd 0.7 x 0.9: 1 -0.65,0; 2 0.65,0
1812 = smd 1.9 x 3.4: 1 -1.95,0; 2 1.95,0
3,2 = hole 3.2: 0,0
SO08@1 = smd 0.61 x 2.21: 1 -1.905,-2.616; 2 -0.635,-2.616; 3 0.635,-2.616; 4 1.905,-2.616; 5 1.905,2.616; 6 0.635,2.616; 7 -0.635,2.616; 8 -1.905,2.616
QFN4X4-16 = smd 1.1 x 0.35: 1 -1.95,0.975; 2 -1.95,0.325; 3 -1.95,-0.325; 4 -1.95,-0.975; 9 1.95,-0.975; 10 1.95,-0.325; 11 1.95,0.325; 12 1.95,0.975 | smd 0.35 x 1.1: 5 -0.975,-1.95; 6 -0.325,-1.95; 7 0.325,-1.95; 8 0.975,-1.95; 13 0.975,1.95; 14 0.325,1.95; 15 -0.325,1.95; 16 -0.975,1.95 | smd 2.1 x 2.1: C 0,0
SOT23-3 = smd 0.8 x 0.9: 1 -0.95,-1; 2 0.95,-1; 3 0,1.1
SOT563 = smd 0.25 x 0.4: 1 0.3,-0.06; 2 0.8,-0.06; 3 1.3,-0.06; 4 1.3,1.26; 5 0.8,1.26; 6 0.3,1.27
BMP085 = smd 1.67 x 0.8: 1 -2.065,1.27; 2 -2.065,0; 3 -2.065,-1.27; 5 2.065,-1.27; 6 2.065,0; 7 2.065,1.27 | smd 0.8 x 1.67: 4 0,-2.065 | smd 0.8 x 2.5: 8 0,1.65
MLF64 = smd 0.7 x 0.3: 1 -4.325,3.75; 2 -4.325,3.25; 3 -4.325,2.75; 4 -4.325,2.25; 5 -4.325,1.75; 6 -4.325,1.25; 7 -4.325,0.75; 8 -4.325,0.25; 9 -4.325,-0.25; 10 -4.325,-0.75; 11 -4.325,-1.25; 12 -4.325,-1.75; 13 -4.325,-2.25; 14 -4.325,-2.75; 15 -4.325,-3.25; 16 -4.325,-3.75; 33 4.325,-3.75; 34 4.325,-3.25; 35 4.325,-2.75; 36 4.325,-2.25; 37 4.325,-1.75; 38 4.325,-1.25; 39 4.325,-0.75; 40 4.325,-0.25; 41 4.325,0.25; 42 4.325,0.75; 43 4.325,1.25; 44 4.325,1.75; 45 4.325,2.25; 46 4.325,2.75; 47 4.325,3.25; 48 4.325,3.75 | smd 0.3 x 0.7: 17 -3.75,-4.325; 18 -3.25,-4.325; 19 -2.75,-4.325; 20 -2.25,-4.325; 21 -1.75,-4.325; 22 -1.25,-4.325; 23 -0.75,-4.325; 24 -0.25,-4.325; 25 0.25,-4.325; 26 0.75,-4.325; 27 1.25,-4.325; 28 1.75,-4.325; 29 2.25,-4.325; 30 2.75,-4.325; 31 3.25,-4.325; 32 3.75,-4.325; 49 3.75,4.325; 50 3.25,4.325; 51 2.75,4.325; 52 2.25,4.325; 53 1.75,4.325; 54 1.25,4.325; 55 0.75,4.325; 56 0.25,4.325; 57 -0.25,4.325; 58 -0.75,4.325; 59 -1.25,4.325; 60 -1.75,4.325; 61 -2.25,4.325; 62 -2.75,4.325; 63 -3.25,4.325; 64 -3.75,4.325 | smd 2 x 2: TGND1 -1.4,1.4; TGND2 -1.4,-1.4; TGND3 1.4,-1.4; TGND4 1.4,1.4
QFN-24 = smd 0.8 x 0.3: 1 -2,1.25; 2 -2,0.75; 3 -2,0.25; 4 -2,-0.25; 5 -2,-0.75; 6 -2,-1.25; 13 2,-1.25; 14 2,-0.75; 15 2,-0.25; 16 2,0.25; 17 2,0.75; 18 2,1.25 | smd 0.3 x 0.8: 7 -1.25,-2; 8 -0.75,-2; 9 -0.25,-2; 10 0.25,-2; 11 0.75,-2; 12 1.25,-2; 19 1.25,2; 20 0.75,2; 21 0.25,2; 22 -0.25,2; 23 -0.75,2; 24 -1.25,2
MSOP10 = smd 0.25 x 1: 1 -1,-2.113; 2 -0.5,-2.113; 3 0,-2.113; 4 0.5,-2.113; 5 1,-2.113; 6 1,2.113; 7 0.5,2.113; 8 0,2.113; 9 -0.5,2.113; 10 -1,2.113
LGA28-5X5 = smd 0.7 x 0.4: 1 -2.3,1.65; 2 -2.3,1.1; 3 -2.3,0.55; 4 -2.3,0; 5 -2.3,-0.55; 6 -2.3,-1.1; 7 -2.3,-1.65; 15 2.3,-1.65; 16 2.3,-1.1; 17 2.3,-0.55; 18 2.3,0; 19 2.3,0.55; 20 2.3,1.1; 21 2.3,1.65 | smd 0.4 x 0.7: 8 -1.65,-2.3; 9 -1.1,-2.3; 10 -0.55,-2.3; 11 0,-2.3; 12 0.55,-2.3; 13 1.1,-2.3; 14 1.65,-2.3; 22 1.65,2.3; 23 1.1,2.3; 24 0.55,2.3; 25 0,2.3; 26 -0.55,2.3; 27 -1.1,2.3; 28 -1.65,2.3
1351 = smd 2.54 x 1.524: 1 8.382,-3.81; 2 8.382,-1.27; 3 8.382,1.27; 4 8.382,3.81; 5 -8.382,3.81; 6 -8.382,1.27; 7 -8.382,-1.27; 8 -8.382,-3.81
SO-08 = smd 0.6 x 2.2: 1 -1.905,-2.6; 2 -0.635,-2.6; 3 0.635,-2.6; 4 1.905,-2.6; 5 1.905,2.6; 6 0.635,2.6; 7 -0.635,2.6; 8 -1.905,2.6
SOT23 = smd 1 x 1.4: 1 -0.95,-1.1; 2 0.95,-1.1; 3 0,1.1
QFN42_MCM = smd 1.1 x 0.3: 1 -2.46,3.25; 2 -2.46,2.75; 3 -2.46,2.25; 4 -2.46,1.75; 5 -2.46,1.25; 6 -2.46,0.75; 7 -2.46,0.25; 8 -2.46,-0.25; 9 -2.46,-0.75; 10 -2.46,-1.25; 11 -2.46,-1.75; 12 -2.46,-2.25; 13 -2.46,-2.75; 14 -2.46,-3.25; 22 2.46,-3.25; 23 2.46,-2.75; 24 2.46,-2.25; 25 2.46,-1.75; 26 2.46,-1.25; 27 2.46,-0.75; 29 2.46,0.25; 30 2.46,0.75; 31 2.46,1.25; 32 2.46,1.75; 33 2.46,2.25; 34 2.46,2.75; 35 2.46,3.25 | smd 0.3 x 0.85: 15 -1.5,-3.61; 16 -1,-3.61; 17 -0.5,-3.61; 18 0,-3.61; 19 0.5,-3.61; 20 1,-3.61; 21 1.5,-3.61; 36 1.5,3.61; 37 1,3.61; 38 0.5,3.61; 39 0,3.61; 40 -0.5,3.61; 41 -1,3.61; 42 -1.5,3.61 | smd 0.85 x 0.3: 28 2.56,-0.25 | drill 0.406: EP1 -0.635,2.286; EP2 0.635,2.286; EP3 -0.635,1.016; EP4 0.635,1.016; EP5 -0.762,-0.635; EP6 0.762,-0.635; EP7 -0.762,-2.159; EP8 0.762,-2.159 | smd 2.8 x 2.6: P$1 0,1.6 | smd 3.2 x 3: P$2 0,-1.4
SOIC16 = smd 0.6 x 1.4: 1 -4.445,-2.715; 2 -3.175,-2.715; 3 -1.905,-2.715; 4 -0.635,-2.715; 5 0.635,-2.715; 6 1.905,-2.715; 7 3.175,-2.715; 8 4.445,-2.715; 9 4.445,2.715; 10 3.175,2.715; 11 1.905,2.715; 12 0.635,2.715; 13 -0.635,2.715; 14 -1.905,2.715; 15 -3.175,2.715; 16 -4.445,2.715
SOT223 = smd 1.219 x 2.235: 1 -2.311,-3.099; 2 0,-3.099; 3 2.311,-3.099 | smd 3.6 x 2.2: 4 0,3.099
WDFN-10L-3X3 = smd 0.85 x 0.3: 1 -1.475,1; 2 -1.475,0.5; 3 -1.475,0; 4 -1.475,-0.5; 5 -1.475,-1; 6 1.475,-1; 7 1.475,-0.5; 8 1.475,0; 9 1.475,0.5; 10 1.475,1 | smd 1.5 x 2.5: EXP 0,0
SOT23-5L = smd 0.55 x 1.2: 1 -0.95,-1.3; 2 0,-1.3; 3 0.95,-1.3; 4 0.95,1.3; 5 -0.95,1.3
ADAFRUIT_MICROSD = smd 0.7 x 1.5: 1 9,-10.64; 2 7.9,-10.24; 3 6.8,-10.64; 4 5.7,-11.04; 5 4.6,-10.64; 6 3.5,-11.04; 7 2.4,-10.64; 8 1.3,-10.64 | smd 1.8 x 1.4: CD1 2,-0.44; CD2 8,-0.44 | smd 1.4 x 1.9: MT1 0.4,-13.54; MT2 13.6,-14.44
2X03PTH = drill 1.016 octagon: 1 -2.54,-1.27; 2 -2.54,1.27; 3 0,-1.27; 4 0,1.27; 5 2.54,-1.27; 6 2.54,1.27
1X02 = drill 0.9 pad 1.93: 1 -1.27,0; 2 1.27,0
22-23-2051 = drill 1 long: 1 -5.08,0; 2 -2.54,0; 3 0,0; 4 2.54,0; 5 5.08,0
1X01 = drill 1.016 octagon: 1 0,0
7395-06 = drill 1.016 long: 1 6.35,0; 2 3.81,0; 3 1.27,0; 4 -1.27,0; 5 -3.81,0; 6 -6.35,0
1X03 = drill 1.016: 1 0,0; 2 2.54,0; 3 5.08,0
J502-ND-142-0701-801/806 = smd 5.08 x 2.286: 1 2.565,0; G@1 2.565,4.42; G@2 2.565,-4.42 | smd 5.08 x 2.286 bottom: G@3 2.565,4.42; G@4 2.565,-4.42
1X08 = drill 1.016 long: 1 -8.89,0; 2 -6.35,0; 3 -3.81,0; 4 -1.27,0; 5 1.27,0; 6 3.81,0; 7 6.35,0; 8 8.89,0
1X03' = drill 0.9 pad 1.93: 1 -2.54,0; 2 0,0; 3 2.54,0
7395-04 = drill 1.016 long: 1 3.81,0; 2 1.27,0; 3 -1.27,0; 4 -3.81,0
1X02' = drill 1.016: 1 0,0; 2 2.54,0
CDRH = smd 7.3 x 2.65: 1 0,2.325; 2 0,-2.325
LED-0603 = smd 0.762 x 0.762: A -0.762,0; C 0.762,0
SMD3215_XTAL = smd 1 x 1.8: X1 -1.23,0.016; X2 1.27,0.016
CRYSTAL-SMD-5X3 = smd 1.9 x 1.1: 1 -1.85,-1.15; 2 1.85,-1.15; 3 1.85,1.15; 4 -1.85,1.15
USB-MICROB = smd 0.35 x 1.4: D+ 0,2.65; D- -0.65,2.65; GND 1.3,2.65; ID 0.65,2.65; VBUS -1.3,2.65 | smd 1.8 x 1.9: MT1 -4,0; MT2 4,0
10POL254 = drill 1.2 long: 1 -11.43,0; 2 -8.89,0; 3 -6.35,0; 4 -3.81,0; 5 -1.27,0; 6 1.27,0; 7 3.81,0; 8 6.35,0; 9 8.89,0; 10 11.43,0
CRYSTAL-SMD-3X2 = smd 1.3 x 1.1: 1 -1.15,-0.9; 2 1.15,-0.9; 3 1.15,0.9; 4 -1.15,0.9

### Placement (x,y rotation side)
B1  38.1,7.62 180 top
B2  24.13,3.18 180 top
C1  38.73,65.41 0 top
C2  37.46,67.31 0 top
C3  38.1,66.04 0 top
C4  38.1,66.04 90 top
C5  38.73,66.67 0 top
C6  38.1,67.31 0 top
C7  39.37,65.41 0 top
C8  40,64.77 0 top
C9  38.73,64.77 0 top
C10  39.37,67.31 0 top
C11  40,65.41 0 top
C12  39.37,66.04 0 top
C13  40.64,65.41 0 top
C14  38.1,65.15 180 top
C15  40,66.04 180 top
C16  39.37,66.04 180 top
C17  38.73,67.31 180 top
C18  40,64.77 0 top
C19  38.73,66.67 0 top
C20  38.73,66.67 0 top
C21  38.1,63.5 180 top
C22  38.73,66.04 0 top
C23  38.73,66.67 180 top
C24  40,66.67 180 top
C25  38.1,67.31 0 top
C26  40.64,67.31 180 top
C27  89.03,10.79 0 top
C28  89.03,15.88 0 top
C29  89.03,20.96 0 top
C30  80.65,70.61 270 top
C31  74.8,61.72 270 top
C32  39.37,65.41 180 top
C33  38.73,66.04 0 top
C34  38.73,65.41 0 top
C35  39.37,66.67 0 top
C36  76.84,61.72 270 top
C37  88.52,42.29 270 top
C38  89.03,36.2 0 top
C39  89.03,26.04 0 top
C40  89.79,28.57 270 top
C41  37.46,65.41 180 top
C42  41.91,66.04 0 top
C43  38.1,64.77 0 top
C44  36.83,67.31 0 top
C45  37.46,66.67 180 top
C46  36.83,67.31 0 top
C47  38.73,67.31 0 top
C48  41.27,66.04 180 top
C49  39.37,65.41 180 top
C50  40,66.04 0 top
C51  39.37,66.67 0 top
C52  38.73,64.77 180 top
C53  35.56,65.41 90 top
C54  38.73,67.95 180 top
F1  38.73,65.41 0 top
H1  4.45,4.45 0 top
H2  4.45,76.84 0 top
H3  87.63,4.45 0 top
H4  87.63,76.84 0 top
IC1  46.99,17.14 0 top
IC2  22.23,13.34 0 top
IC3  13.34,50.8 0 top
IC4  15.24,44.45 90 top
IC5  28.57,24.13 0 top
IC6  36.2,33.65 0 top
IC7  22.23,21.59 0 top
IC8  20.32,51.43 0 top
IC9  29.84,17.14 90 top
IC10  59.05,6.99 0 top
IC11  28.57,52.07 270 top
IC12  80.01,66.04 180 top
IC13  75.56,34.29 270 top
IC14  72.39,67.31 180 top
IC15  23.5,32.38 0 top
IC16  14.61,55.24 0 top
IC17  15.88,28.57 270 top
IC18  21.59,42.54 0 top
J1  17.78,23.5 270 top
J2  8.26,39.37 0 top
J3  8.89,62.87 90 top
J4  35.56,77.47 180 top
J5  5.08,51.43 0 top
J6  19.05,77.47 180 top
J7  11.43,32.38 180 top
J8  76.84,1.9 90 top
J9  73.66,44.45 0 top
J10  [1X03']  74.93,26.04 0 top
J11  65.41,36.83 180 top
J12  [1X03']  64.14,30.48 180 top
J13  49.53,77.47 180 top
J14  Arm  [1X02']  5.71,46.35 0 top
J15  5.08,62.23 90 top
J16  Status  [1X02']  5.08,57.15 0 top
L1  88.27,13.34 90 top
L2  88.27,18.41 90 top
L3  88.27,23.5 90 top
L4  39.37,65.41 0 top
L5  87.76,44.7 180 top
L6  88.52,38.73 90 top
L7  89.79,33.65 90 top
L8  89.03,31.11 180 top
L9  27.94,68.58 90 top
LED1  39.37,66.67 180 top
LED2  39.37,64.14 0 top
LED3  39.37,66.67 0 top
LED4  38.73,66.04 180 top
LED5  38.73,66.04 180 top
LED6  38.73,67.95 0 top
LED7  37.46,65.41 0 top
Q1  41.91,17.14 90 top
Q2  19.68,58.42 0 top
Q3  71.76,60.96 0 top
Q4  30.1,44.45 0 top
Q5  75.56,50.16 180 top
Q6  67.95,60.96 0 top
Q7  64.14,60.96 0 top
Q8  64.77,65.41 180 top
Q9  16.51,34.29 180 top
R1  39.37,66.67 0 top
R2  38.1,64.77 0 top
R3  38.73,66.04 90 top
R4  36.83,65.41 0 top
R5  39.37,66.04 0 top
R6  38.73,64.77 0 top
R7  40,65.41 0 top
R8  39.37,65.41 0 top
R9  39.37,64.77 0 top
R10  40,64.77 0 top
R11  39.37,67.31 0 top
R12  39.37,66.04 180 top
R13  38.1,66.04 0 top
R14  40,65.41 0 top
R15  39.37,66.67 0 top
R16  38.73,66.04 0 top
R17  41.27,68.58 0 top
R18  39.37,65.41 180 top
R19  38.73,64.77 0 top
R20  39.37,69.22 0 top
R21  40,66.04 180 top
R22  40.64,66.67 180 top
R23  38.73,66.67 0 top
R24  39.37,65.41 180 top
R25  36.83,65.41 180 top
R26  40,67.31 270 top
R27  39.37,66.04 180 top
R28  38.73,66.67 180 top
R29  39.37,65.41 0 top
R30  39.37,66.04 0 top
R31  38.73,64.14 90 top
R32  38.73,64.77 0 top
R33  38.73,66.67 0 top
R34  39.37,67.31 180 top
R35  40.64,68.58 0 top
R36  37.46,66.04 180 top
R37  40,64.77 0 top
R38  40.64,66.04 0 top
SY  5.08,69.22 0 top
X1  14.61,3.18 0 top
X2  69.85,77.47 180 top
XTL1  38.1,42.54 0 top

### Tracks (layer width: path | path; a pad name or v marks a point on that pad's centre or on a via)
5V_MISO  (2 unrouted)
  Top 0.203: Q6.3 70.31,62.06 71.76,63.5 IC14.12
5V_MOSI  (2 unrouted)
  Top 0.203: IC14.11 70.48,63.5 70.1,63.12 66.17,63.12 65.11,62.06 Q7.3
5V_SCK  (2 unrouted)
  Top 0.203: IC14.13 73.03,63.33 Q3.3
!ACCEL_CS  (2 unrouted)
!ADC2_CS  (2 unrouted)
!ADC_CS  (2 unrouted)
!ADC_CS_5V  (1 unrouted)
  Top 0.203: Q8.3 65.58,64.31 67.31,66.04 68.83,66.04 69.22,65.66 IC14.10
!CARD  (2 unrouted)
!LBO  (3 unrouted)
!PGOOD  (2 unrouted)
!RESET  (3 unrouted)
!SD_CS  (2 unrouted)
!SI1000_ENABLE  (2 unrouted)
+3V3  (51 unrouted)
  Top 0.203: Q7.1 63.18,58.99 63.5,58.67 66.67,58.67 67,58.99 | Q6.1 67,58.99 | Q3.1 70.81,58.99 70.48,58.67 67.31,58.67 67,58.99
+5V  (13 unrouted)
  Top 0.203: IC14.16 C36.1 80.9,62.48 81.92,63.5 81.92,66.04 80.96,67 IC12.1 80.96,68.27 80.65,68.58 C30.2
ANALOG_BAROMETER  (2 unrouted)
BATTERY_VOLTAGE  (6 unrouted)
FB1  (2 unrouted)
GND  (67 unrouted)
  pour Top (isolate 0.254): -1.27,82.55 93.34,81.92 93.34,-1.27 -1.27,-1.27
GPS_RXD  (1 unrouted)
GPS_TXD  (1 unrouted)
LBI1  (2 unrouted)
LX1  (1 unrouted)
MICRO_RXD  (1 unrouted)
MICRO_TXD  (1 unrouted)
MISO  (4 unrouted)
MOSI  (4 unrouted)
N$1  (2 unrouted)
N$2  (7 unrouted)
N$3  (2 unrouted)
N$4  (1 unrouted)
N$5  (1 unrouted)
N$6  (1 unrouted)
  Top 0.61: L1.1 88.27,11.81 88.38,11.7 C27.1 87,10.79
  Top 0.813: 76.84,3.81 76.84,7.62 arc-90 80.01,10.79 87,10.79
N$7  (1 unrouted)
N$8  (1 unrouted)
N$9  (1 unrouted)
N$10  (1 unrouted)
N$11  (1 unrouted)
N$12
  Top 0.406: Q1.X2 43.81,18.41 46.35,15.88 IC1.2
N$13
  Top 0.406: IC1.3 47.62,12.07 45.97,10.41 B1.PWR@1
N$14
  Top 0.406: IC1.1 45.08,15.24 44.41,15.91 Q1.X1
N$15  (1 unrouted)
N$16  (1 unrouted)
N$17  (1 unrouted)
N$18  (1 unrouted)
N$19  (3 unrouted)
N$20  (1 unrouted)
N$21  (1 unrouted)
N$22  (1 unrouted)
N$23  (3 unrouted)
N$24  (1 unrouted)
N$25  (1 unrouted)
N$26  (1 unrouted)
N$27  (1 unrouted)
N$28  (4 unrouted)
N$29
  Top 0.203: IC14.8 67.95,71.76 63.5,76.2 X2.8
N$30
  Top 0.203: IC14.7 69.22,71.76 66.04,74.93 X2.7
N$31  (1 unrouted)
N$32  (2 unrouted)
N$33  (1 unrouted)
N$34  (1 unrouted)
N$35  (2 unrouted)
N$36
  Top 0.203: IC14.6 70.48,71.76 68.58,73.66 X2.6
N$37
  Top 0.203: IC14.5 71.76,71.76 71.12,72.39 X2.5
N$38
  Top 0.203: IC14.4 73.03,71.76 73.66,72.39 X2.4
N$39
  Top 0.203: IC14.3 74.3,71.76 76.2,73.66 X2.3
N$40
  Top 0.203: IC14.2 75.56,71.76 78.74,74.93 X2.2
N$41
  Top 0.203: IC14.1 76.84,71.76 81.28,76.2 X2.1
N$42  (1 unrouted)
N$43
  Top 0.203: C31.1 75.56,63.25 IC14.15 75.56,66.04 76.67,67.14 IC12.2
N$44  (1 unrouted)
N$45  (1 unrouted)
N$46  (2 unrouted)
N$47  (2 unrouted)
N$48  (1 unrouted)
N$49  (1 unrouted)
N$50  (1 unrouted)
N$51  (1 unrouted)
N$52  (1 unrouted)
N$54  (1 unrouted)
N$55  (1 unrouted)
N$56  (1 unrouted)
N$58  (2 unrouted)
N$59  (2 unrouted)
N$60  (2 unrouted)
N$61  (1 unrouted)
N$64  (1 unrouted)
N$65  (1 unrouted)
N$68  (1 unrouted)
N$69  (2 unrouted)
N$74  (1 unrouted)
N$75  (1 unrouted)
N$76  (1 unrouted)
N$77  (1 unrouted)
N$78  (1 unrouted)
N$79  (1 unrouted)
N$80  (1 unrouted)
N$81  (1 unrouted)
N$82  (2 unrouted)
N$83  (1 unrouted)
N$84  (1 unrouted)
N$86  (2 unrouted)
N$87  (1 unrouted)
N$89  (3 unrouted)
N$90  (1 unrouted)
N$92  (2 unrouted)
N$93  (2 unrouted)
N$96  (4 unrouted)
SCK  (5 unrouted)
SCL  (7 unrouted)
SDA  (7 unrouted)
SI1000_RXD  (2 unrouted)
SI1000_TXD  (2 unrouted)
UART_SELECT  (3 unrouted)
USB_RXD  (2 unrouted)
USB_TXD  (2 unrouted)
USBVCC  (8 unrouted)
V_BATT  (9 unrouted)